# EAGLE design AutoPBT (EAGLE 9.7.0)
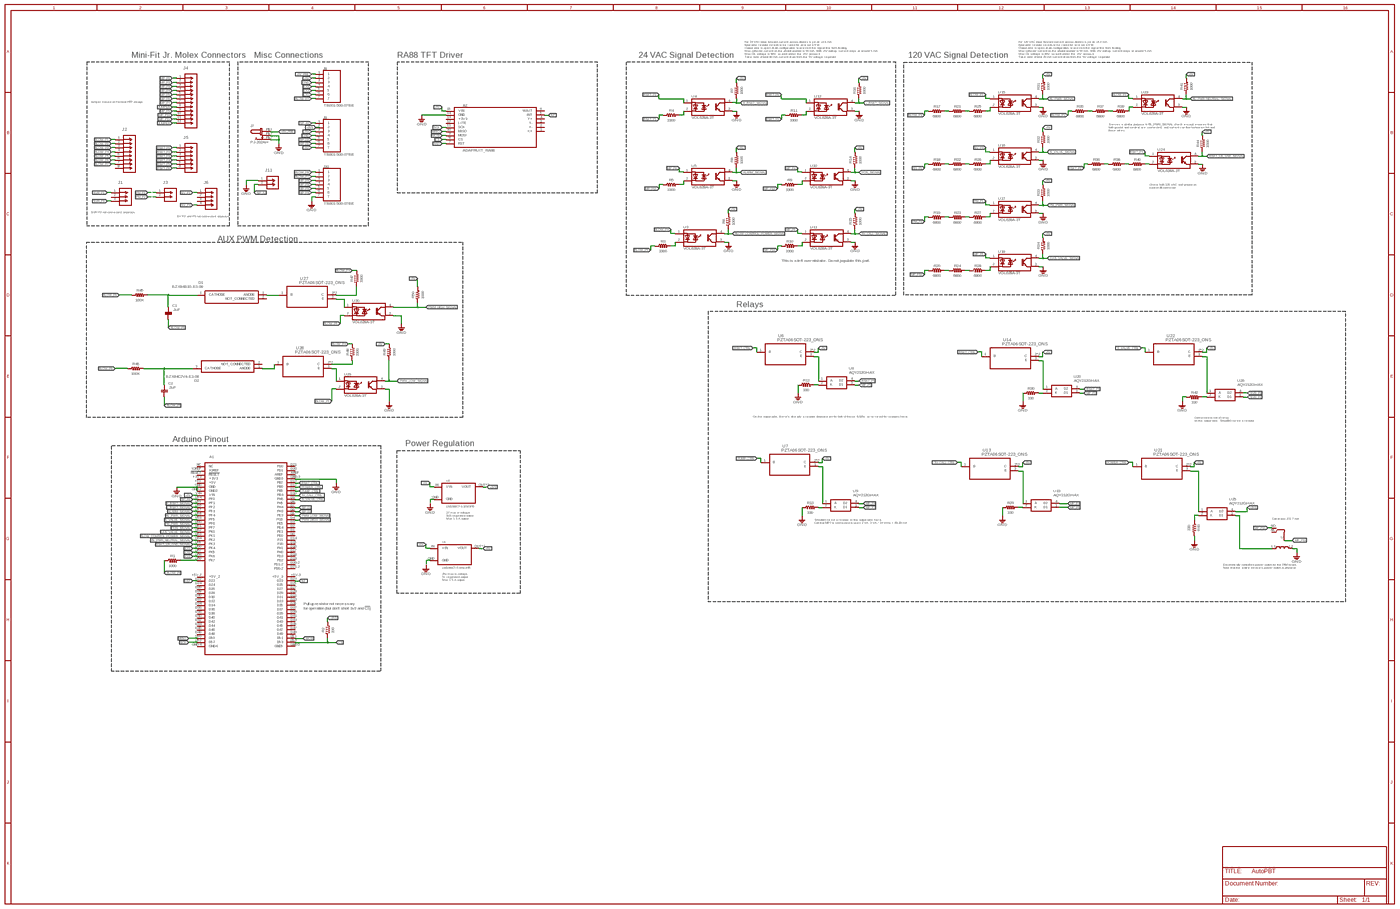
[diagram p0: schematic, sheet 1, overview]
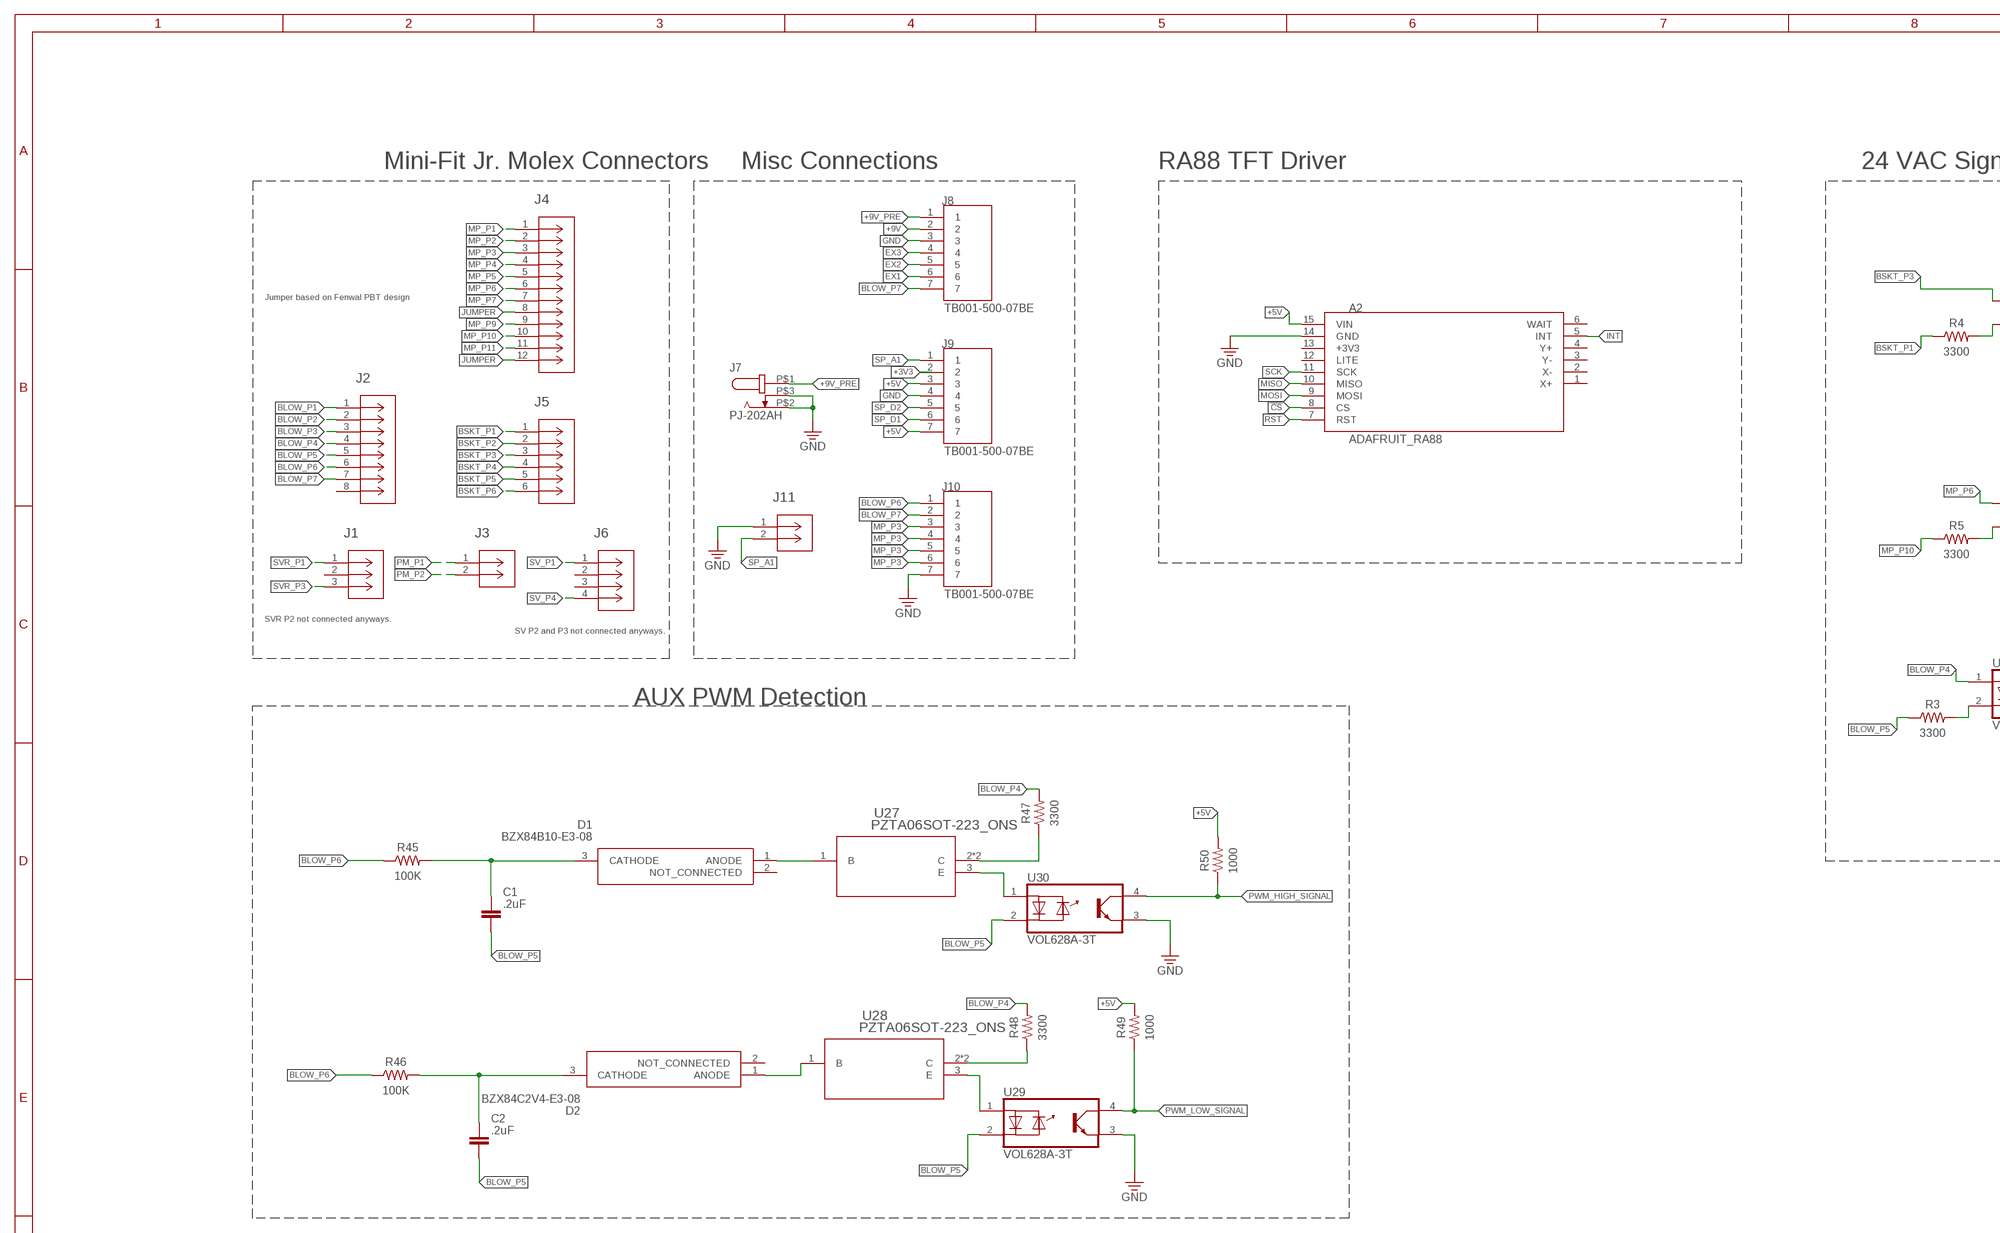
[diagram p1: schematic, sheet 1, part 1 of 4]
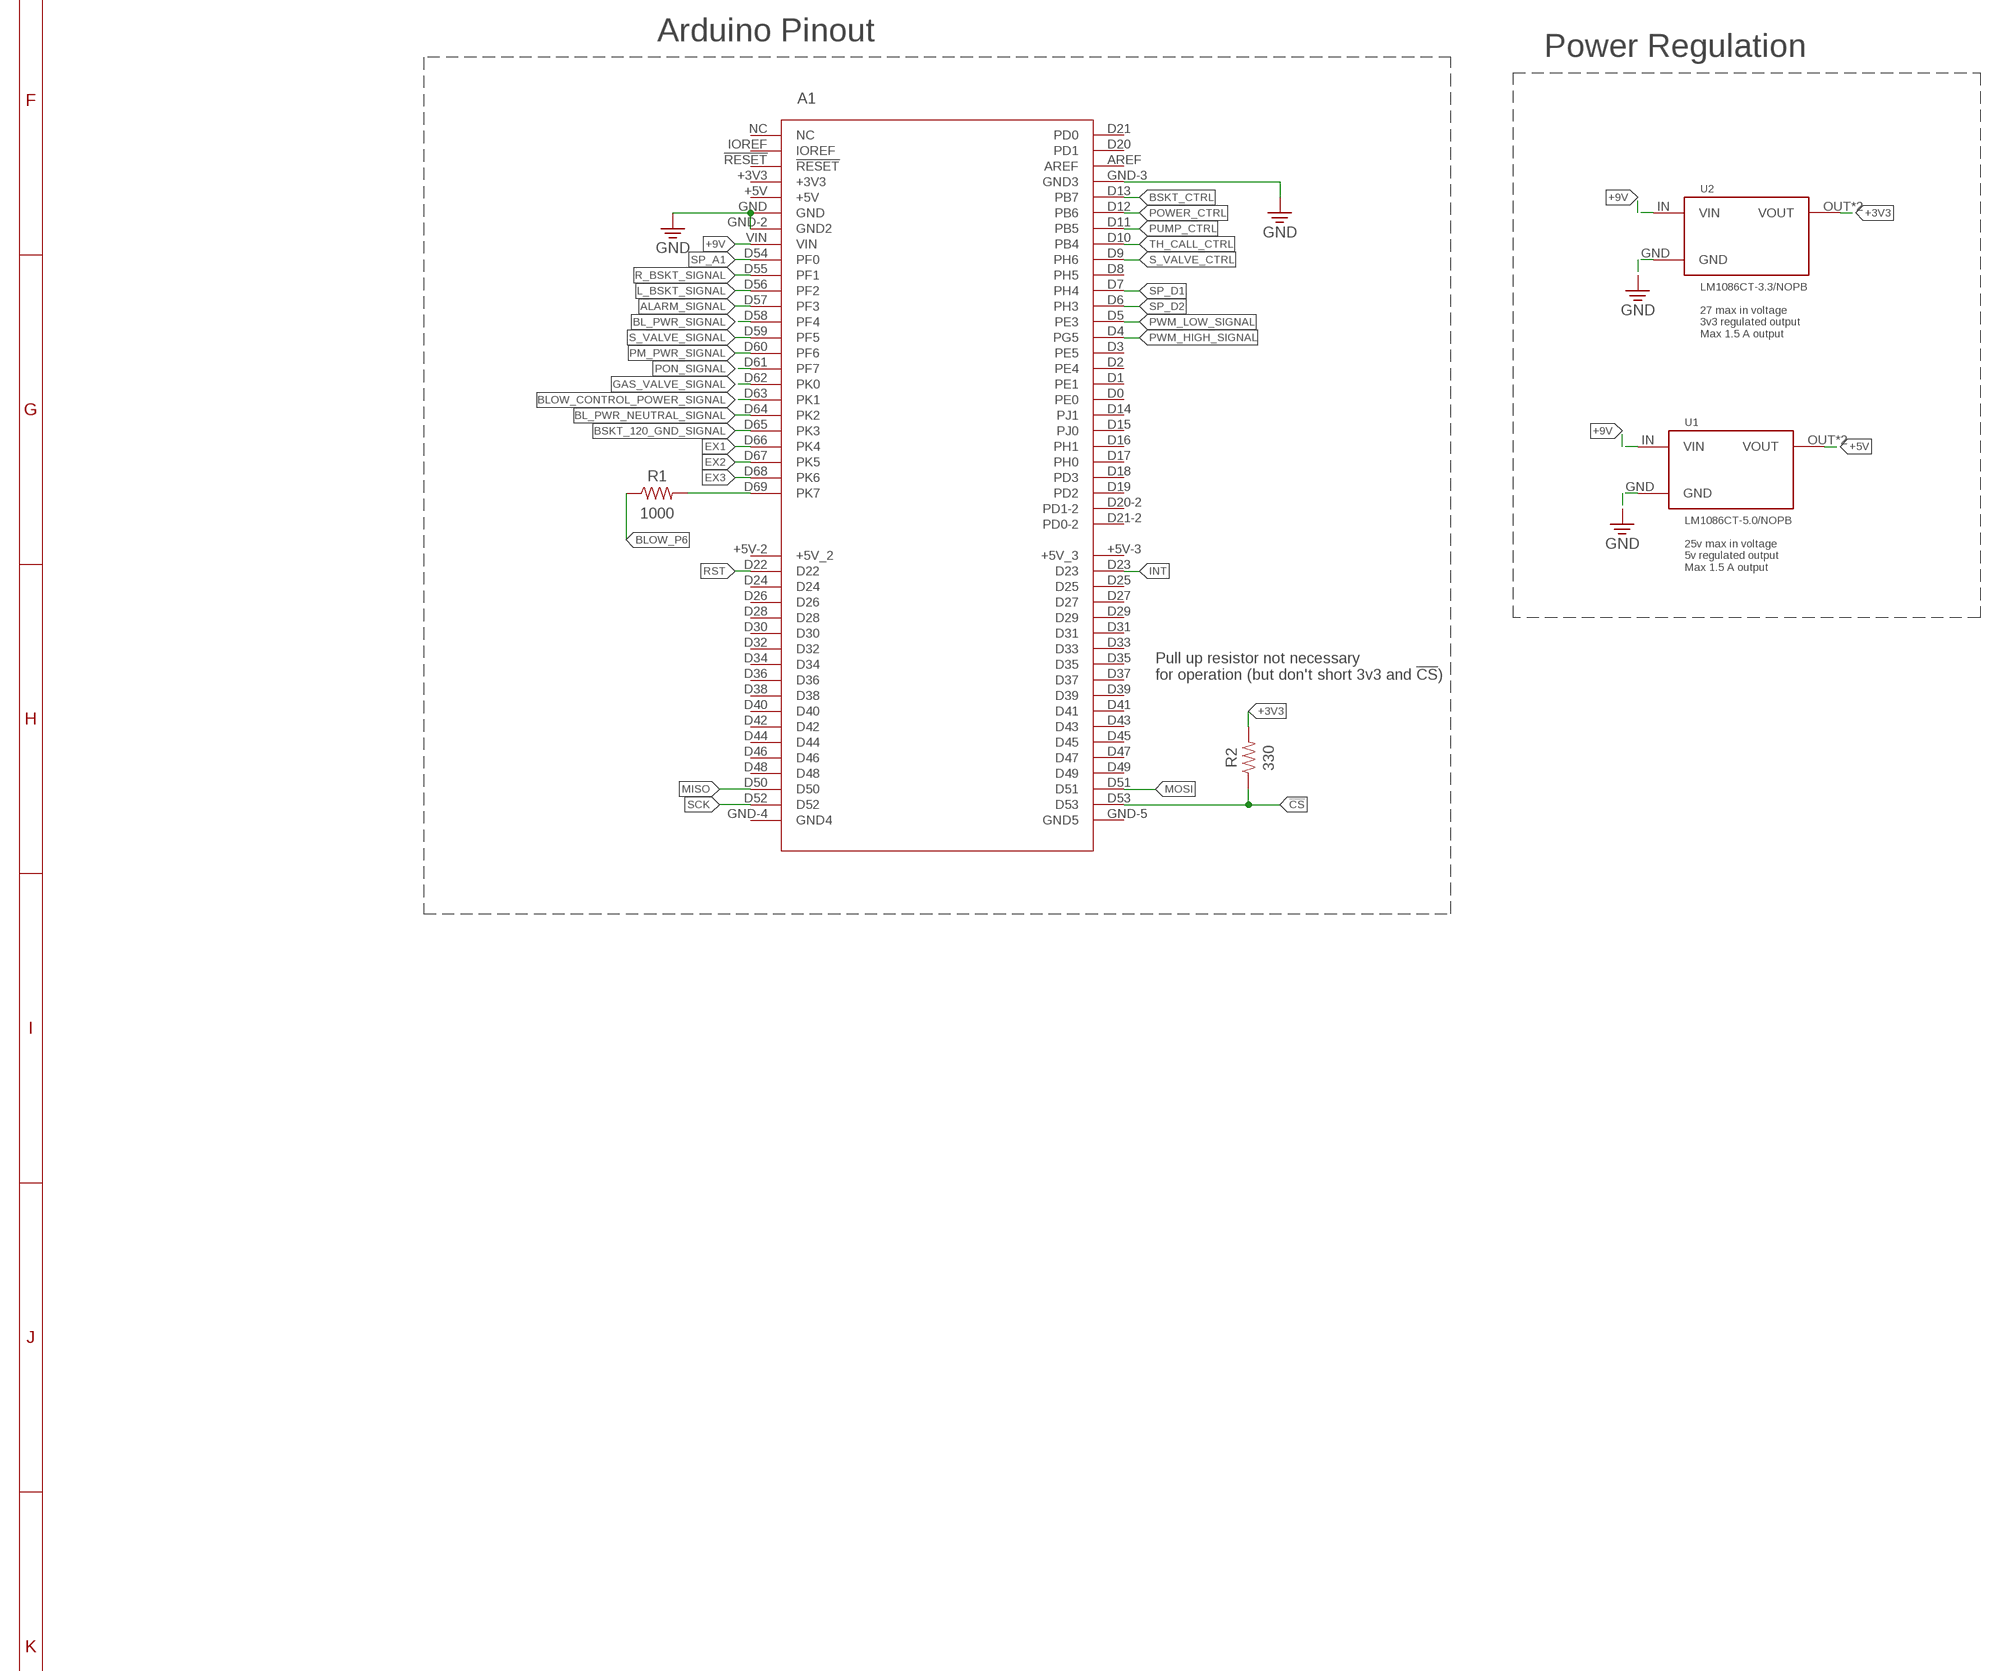
[diagram p2: schematic, sheet 1, part 2 of 4]
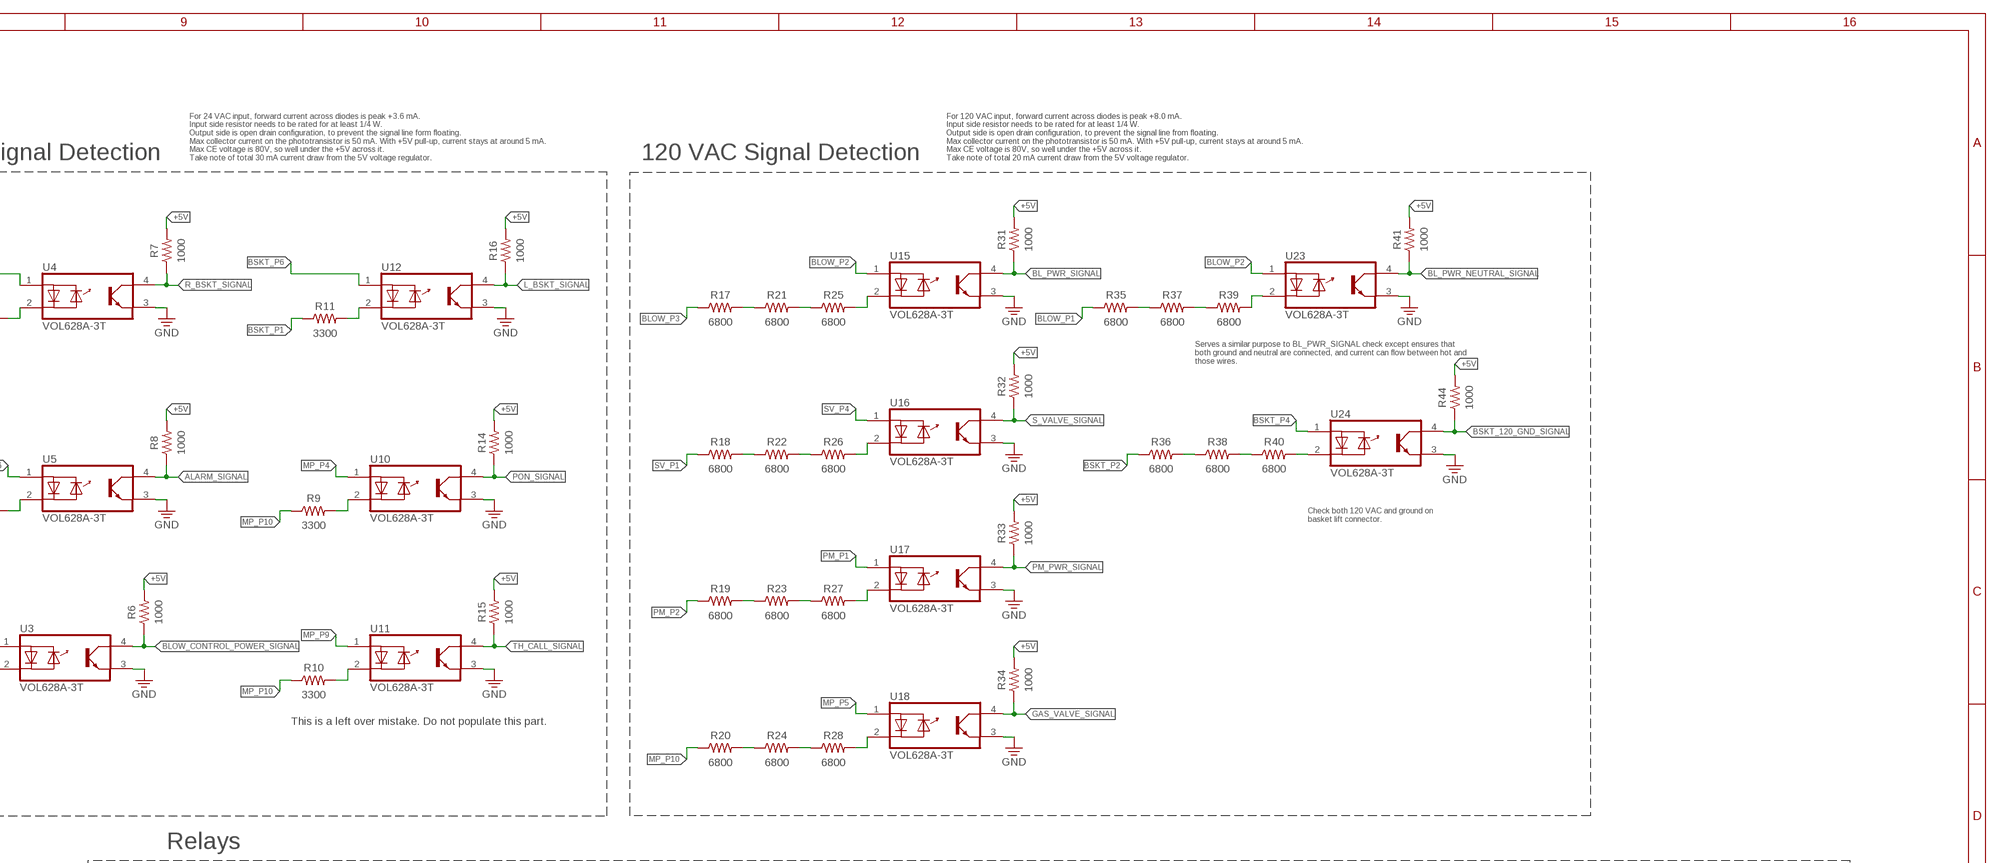
[diagram p3: schematic, sheet 1, part 3 of 4]
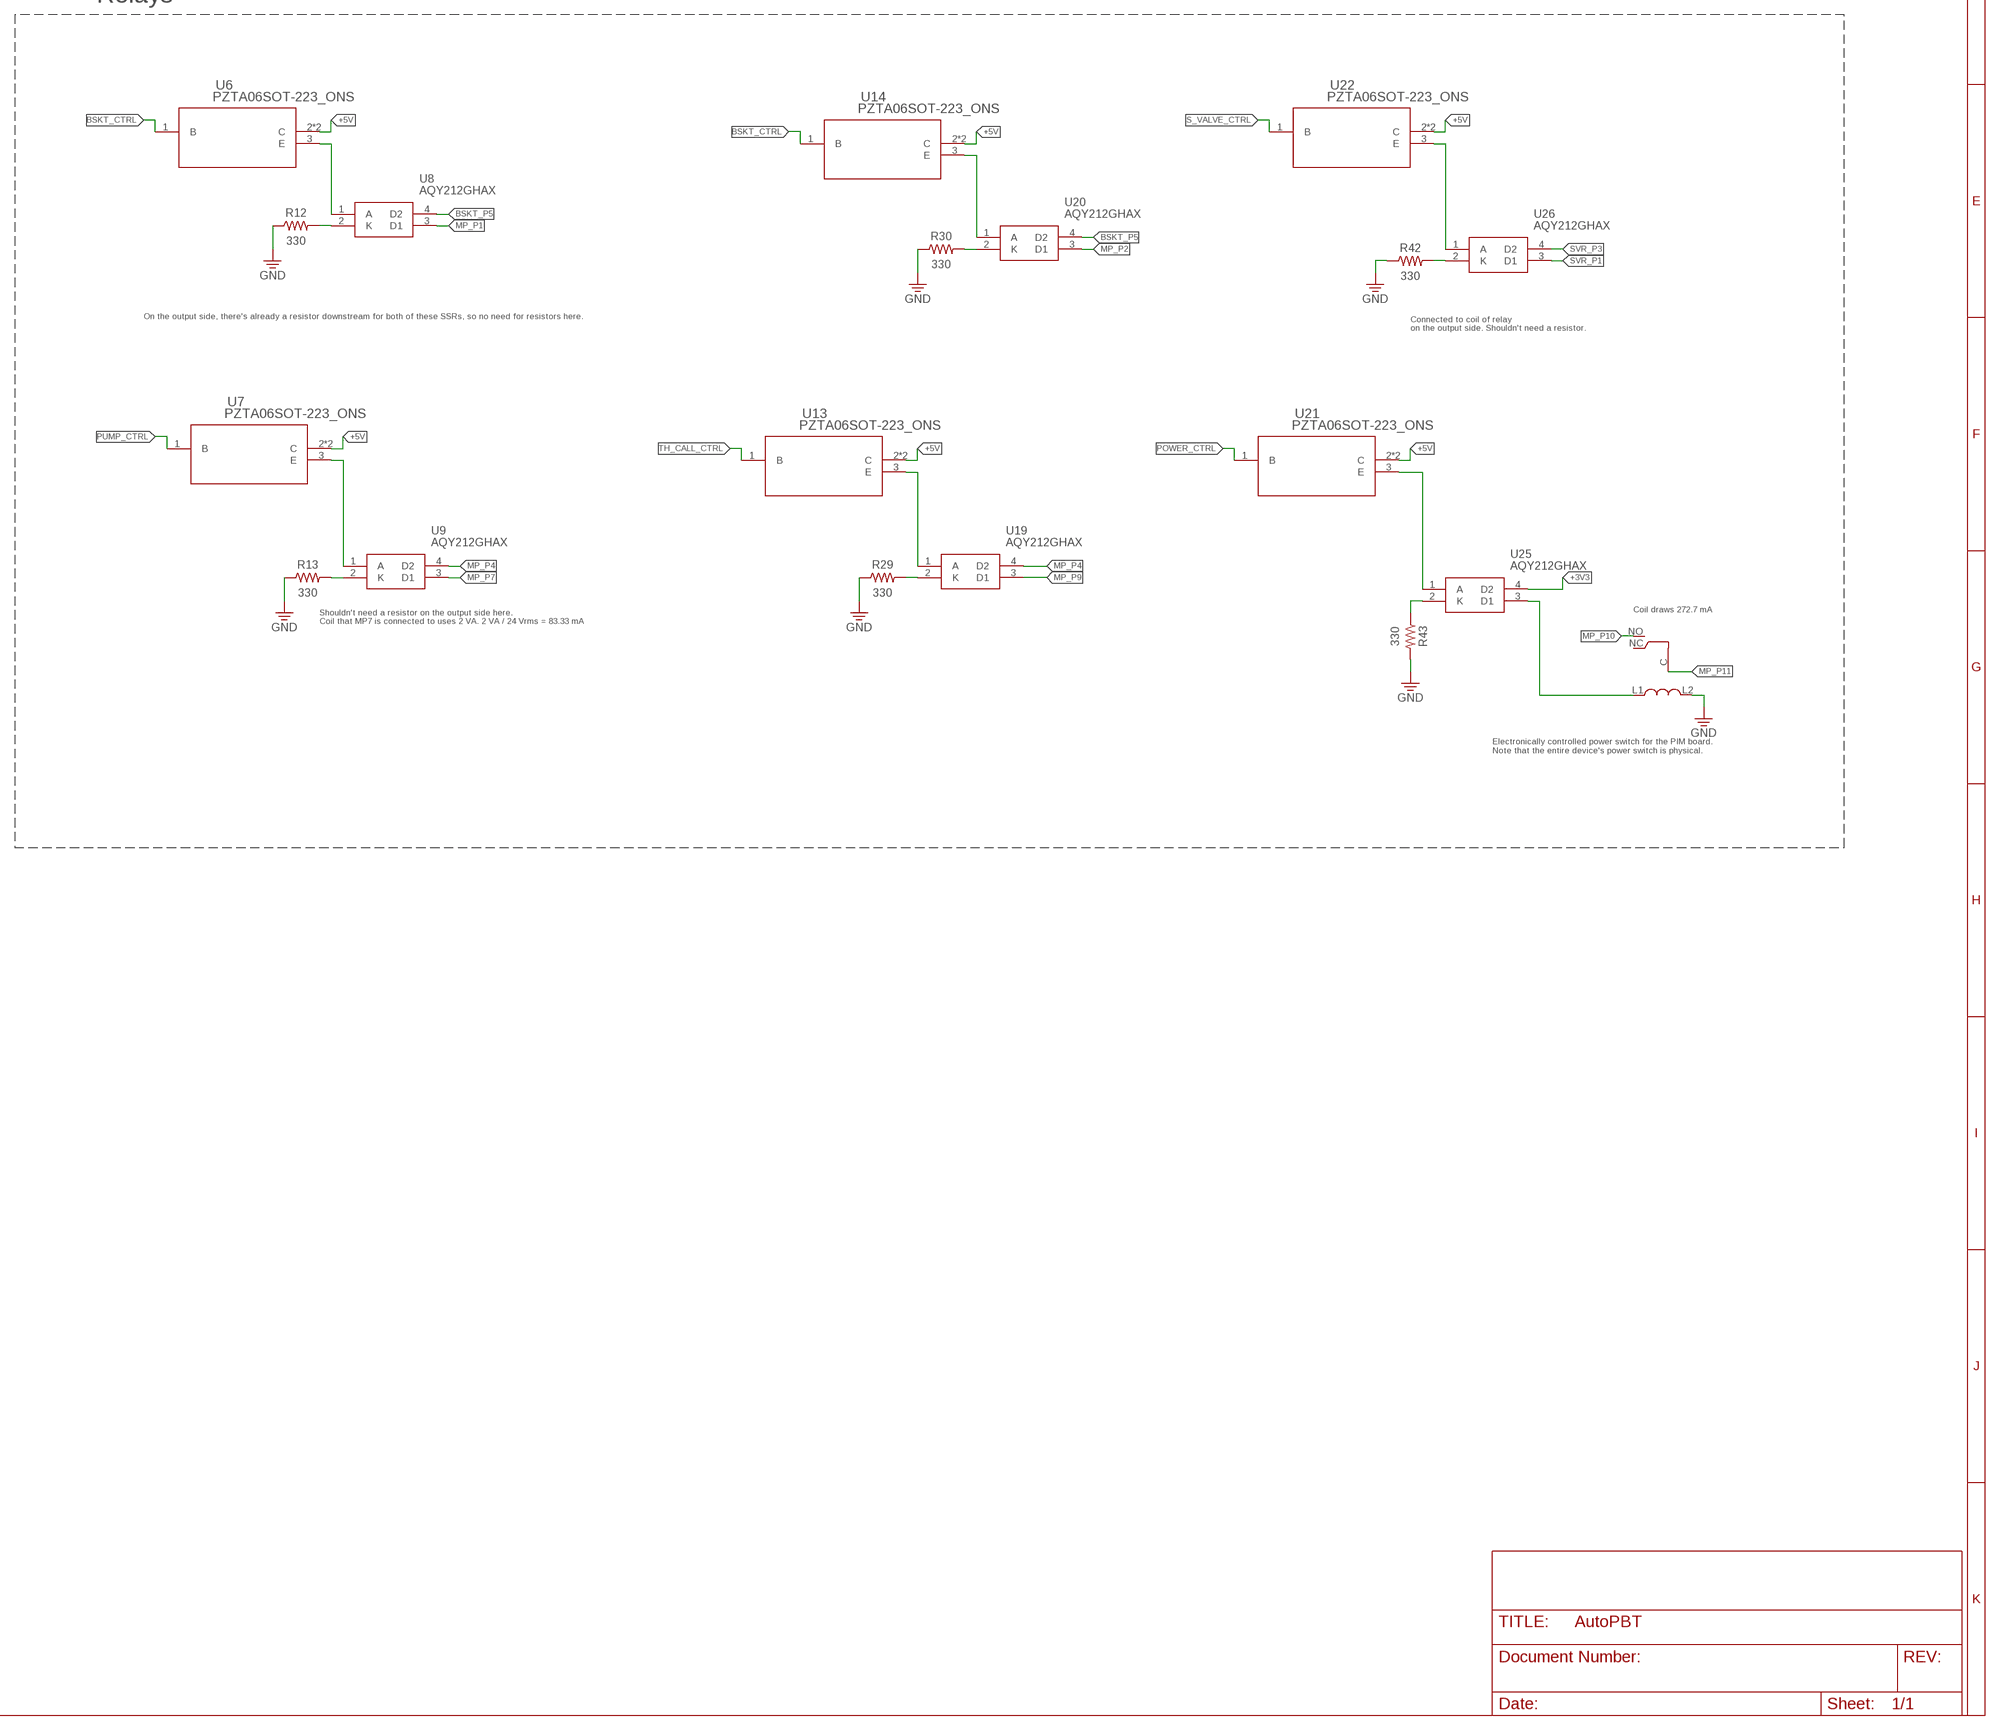
[diagram p4: schematic, sheet 1, part 4 of 4]

## Parts
A1  ARDUINO2560ARDUINO2560ACTUAL  [ARDUINO2560PINS]
A2  ADAFRUIT_RA88  [RA88]
C1  .2uF  C_CHIP-0603(1608-METRIC)  [CAPC1608X85]
C2  .2uF  C_CHIP-0603(1608-METRIC)  [CAPC1608X85]
D1  BZX84B10-E3-08  [SOT95P248X115-3N]
D2  BZX84C2V4-E3-08  [SOT95P248X115-3N]
J1  39301039CON_39301039  [CON_39301039]
J2  39281083CON_39281083  [CON_39281083]
J3  39281023CON_39281023  [CON_39281023]
J4  39281123CON_39281123  [CON_39281123]
J5  39281063CON_39281063  [CON_39281063]
J6  39299046CON_39299046  [CON_39299046]
J7  PJ-202AH  [CUI_PJ-202AH]
J8  TB001-500-07BE  [CUI_TB001-500-07BE]
J9  TB001-500-07BE  [CUI_TB001-500-07BE]
J10  TB001-500-07BE  [CUI_TB001-500-07BE]
J11  430450212CON_430450212_MOL  [CON_430450212_MOL]
K1  J107F1CS203VDC.80  [J107F1CS203VDC.80]
R1  1000  R-US_CHIP-0603(1608-METRIC)  [RESC1608X60]
R2  330  R-US_CHIP-0603(1608-METRIC)  [RESC1608X60]
R3  3300  R-US_CHIP-0603(1608-METRIC)  [RESC1608X60]
R4  3300  R-US_CHIP-0603(1608-METRIC)  [RESC1608X60]
R5  3300  R-US_CHIP-0603(1608-METRIC)  [RESC1608X60]
R6  1000  R-US_CHIP-0603(1608-METRIC)  [RESC1608X60]
R7  1000  R-US_CHIP-0603(1608-METRIC)  [RESC1608X60]
R8  1000  R-US_CHIP-0603(1608-METRIC)  [RESC1608X60]
R9  3300  R-US_CHIP-0603(1608-METRIC)  [RESC1608X60]
R10  3300  R-US_CHIP-0603(1608-METRIC)  [RESC1608X60]
R11  3300  R-US_CHIP-0603(1608-METRIC)  [RESC1608X60]
R12  330  R-US_CHIP-0603(1608-METRIC)  [RESC1608X60]
R13  330  R-US_CHIP-0603(1608-METRIC)  [RESC1608X60]
R14  1000  R-US_CHIP-0603(1608-METRIC)  [RESC1608X60]
R15  1000  R-US_CHIP-0603(1608-METRIC)  [RESC1608X60]
R16  1000  R-US_CHIP-0603(1608-METRIC)  [RESC1608X60]
R17  6800  R-US_CHIP-0603(1608-METRIC)  [RESC1608X60]
R18  6800  R-US_CHIP-0603(1608-METRIC)  [RESC1608X60]
R19  6800  R-US_CHIP-0603(1608-METRIC)  [RESC1608X60]
R20  6800  R-US_CHIP-0603(1608-METRIC)  [RESC1608X60]
R21  6800  R-US_CHIP-0603(1608-METRIC)  [RESC1608X60]
R22  6800  R-US_CHIP-0603(1608-METRIC)  [RESC1608X60]
R23  6800  R-US_CHIP-0603(1608-METRIC)  [RESC1608X60]
R24  6800  R-US_CHIP-0603(1608-METRIC)  [RESC1608X60]
R25  6800  R-US_CHIP-0603(1608-METRIC)  [RESC1608X60]
R26  6800  R-US_CHIP-0603(1608-METRIC)  [RESC1608X60]
R27  6800  R-US_CHIP-0603(1608-METRIC)  [RESC1608X60]
R28  6800  R-US_CHIP-0603(1608-METRIC)  [RESC1608X60]
R29  330  R-US_CHIP-0603(1608-METRIC)  [RESC1608X60]
R30  330  R-US_CHIP-0603(1608-METRIC)  [RESC1608X60]
R31  1000  R-US_CHIP-0603(1608-METRIC)  [RESC1608X60]
R32  1000  R-US_CHIP-0603(1608-METRIC)  [RESC1608X60]
R33  1000  R-US_CHIP-0603(1608-METRIC)  [RESC1608X60]
R34  1000  R-US_CHIP-0603(1608-METRIC)  [RESC1608X60]
R35  6800  R-US_CHIP-0603(1608-METRIC)  [RESC1608X60]
R36  6800  R-US_CHIP-0603(1608-METRIC)  [RESC1608X60]
R37  6800  R-US_CHIP-0603(1608-METRIC)  [RESC1608X60]
R38  6800  R-US_CHIP-0603(1608-METRIC)  [RESC1608X60]
R39  6800  R-US_CHIP-0603(1608-METRIC)  [RESC1608X60]
R40  6800  R-US_CHIP-0603(1608-METRIC)  [RESC1608X60]
R41  1000  R-US_CHIP-0603(1608-METRIC)  [RESC1608X60]
R42  330  R-US_CHIP-0603(1608-METRIC)  [RESC1608X60]
R43  330  R-US_CHIP-0603(1608-METRIC)  [RESC1608X60]
R44  1000  R-US_CHIP-0603(1608-METRIC)  [RESC1608X60]
R45  100K  R-US_CHIP-0603(1608-METRIC)  [RESC1608X60]
R46  100K  R-US_CHIP-0603(1608-METRIC)  [RESC1608X60]
R47  3300  R-US_CHIP-0603(1608-METRIC)  [RESC1608X60]
R48  3300  R-US_CHIP-0603(1608-METRIC)  [RESC1608X60]
R49  1000  R-US_CHIP-0603(1608-METRIC)  [RESC1608X60]
R50  1000  R-US_CHIP-0603(1608-METRIC)  [RESC1608X60]
U1  LM1086CT-5.0/NOPB  [LM1086CT-3.3/NOPB]
U2  LM1086CT-3.3/NOPB  [LM1086CT-3.3/NOPB]
U3  VOL628A-3T  [SOIC254P1020X230-4N]
U4  VOL628A-3T  [SOIC254P1020X230-4N]
U5  VOL628A-3T  [SOIC254P1020X230-4N]
U6  PZTA06SOT-223_ONS  [SOT-223_ONS]
U7  PZTA06SOT-223_ONS  [SOT-223_ONS]
U8  AQY212GHAX  [SOP254P962X315-4N]
U9  AQY212GHAX  [SOP254P962X315-4N]
U10  VOL628A-3T  [SOIC254P1020X230-4N]
U11  VOL628A-3T  [SOIC254P1020X230-4N]
U12  VOL628A-3T  [SOIC254P1020X230-4N]
U13  PZTA06SOT-223_ONS  [SOT-223_ONS]
U14  PZTA06SOT-223_ONS  [SOT-223_ONS]
U15  VOL628A-3T  [SOIC254P1020X230-4N]
U16  VOL628A-3T  [SOIC254P1020X230-4N]
U17  VOL628A-3T  [SOIC254P1020X230-4N]
U18  VOL628A-3T  [SOIC254P1020X230-4N]
U19  AQY212GHAX  [SOP254P962X315-4N]
U20  AQY212GHAX  [SOP254P962X315-4N]
U21  PZTA06SOT-223_ONS  [SOT-223_ONS]
U22  PZTA06SOT-223_ONS  [SOT-223_ONS]
U23  VOL628A-3T  [SOIC254P1020X230-4N]
U24  VOL628A-3T  [SOIC254P1020X230-4N]
U25  AQY212GHAX  [SOP254P962X315-4N]
U26  AQY212GHAX  [SOP254P962X315-4N]
U27  PZTA06SOT-223_ONS  [SOT-223_ONS]
U28  PZTA06SOT-223_ONS  [SOT-223_ONS]
U29  VOL628A-3T  [SOIC254P1020X230-4N]
U30  VOL628A-3T  [SOIC254P1020X230-4N]

## Nets
!CS! [SPI]: A1.D53 A2.8(CS) R2.1
+3V3: J9.2 R2.2 U2.OUT2(VOUT) U2.OUT(VOUT) U25.4(D2)
+5V: A2.15(VIN) J9.3 J9.7 R6.2 R7.2 R8.2 R14.2 R15.2 R16.2 R31.2 R32.2 R33.2 R34.2 R41.2 R44.2 R49.2 R50.2 U1.OUT2(VOUT) U1.OUT(VOUT) U6.2(C) U6.4(C) U7.2(C) U7.4(C) U13.2(C) U13.4(C) U14.2(C) U14.4(C) U21.2(C) U21.4(C) U22.2(C) U22.4(C)
+9V: A1.VIN J8.2 U1.IN(VIN) U2.IN(VIN)
+9V_PRE: J7.P$1 J8.1
ALARM_SIGNAL: A1.D57(PF3) R8.1 U5.4(CO)
BL_PWR_NEUTRAL_SIGNAL: A1.D64(PK2) R41.1 U23.4(CO)
BL_PWR_SIGNAL: A1.D58(PF4) R31.1 U15.4(CO)
BLOW_CONTROL_POWER_SIGNAL: A1.D63(PK1) R6.1 U3.4(CO)
BLOW_P1: J2.1 R35.1
BLOW_P2: J2.2 U15.1(A/C) U23.1(A/C)
BLOW_P3: J2.3 R17.1
BLOW_P4: J2.4 R47.2 R48.2 U3.1(A/C)
BLOW_P5: C1.2 C2.2 J2.5 R3.1 U29.2(C/A) U30.2(C/A)
BLOW_P6: J2.6 J10.1 R1.1 R45.1 R46.1
BLOW_P7: J2.7 J8.7 J10.2
BSKT_120_GND_SIGNAL: A1.D65(PK3) R44.1 U24.4(CO)
BSKT_CTRL: A1.D13(PB7) U6.1(B) U14.1(B)
BSKT_P1: J5.1 R4.1 R11.1
BSKT_P2: J5.2 R36.1
BSKT_P3: J5.3 U4.1(A/C)
BSKT_P4: J5.4 U24.1(A/C)
BSKT_P5: J5.5 U8.4(D2) U20.4(D2)
BSKT_P6: J5.6 U12.1(A/C)
EX1: A1.D66(PK4) J8.6
EX2: A1.D67(PK5) J8.5
EX3: A1.D68(PK6) J8.4
GAS_VALVE_SIGNAL: A1.D62(PK0) R34.1 U18.4(CO)
GND: A1.GND A1.GND-2(GND2) A1.GND-3(GND3) A2.14(GND) J7.P$2 J7.P$3 J8.3 J9.4 J10.7 J11.1 K1.L2 R12.1 R13.1 R29.1 R30.1 R42.1 R43.2 U1.GND U2.GND U3.3(E) U4.3(E) U5.3(E) U10.3(E) U11.3(E) U12.3(E) U15.3(E) U16.3(E) U17.3(E) U18.3(E) U23.3(E) U24.3(E) U29.3(E) U30.3(E)
INT: A1.D23 A2.5(INT)
JUMPER: J4.8 J4.12
L_BSKT_SIGNAL: A1.D56(PF2) R16.1 U12.4(CO)
MISO [SPI]: A1.D50 A2.10(MISO)
MOSI [SPI]: A1.D51 A2.9(MOSI)
MP_P1: J4.1 U8.3(D1)
MP_P2: J4.2 U20.3(D1)
MP_P3: J4.3 J10.3 J10.4 J10.5 J10.6
MP_P4: J4.4 U9.4(D2) U10.1(A/C) U19.4(D2)
MP_P5: J4.5 U18.1(A/C)
MP_P6: J4.6 U5.1(A/C)
MP_P7: J4.7 U9.3(D1)
MP_P9: J4.9 U11.1(A/C) U19.3(D1)
MP_P10: J4.10 K1.NO R5.1 R9.1 R10.1 R20.1
MP_P11: J4.11 K1.C
N$1: R30.2 U20.2(K)
N$2: R29.2 U19.2(K)
N$3: R13.2 U9.2(K)
N$4: U6.3(E) U8.1(A)
N$5: R42.2 U26.2(K)
N$6: R43.1 U25.2(K)
N$8: U14.3(E) U20.1(A)
N$9: R39.2 U23.2(C/A)
N$10: R37.2 R39.1
N$11: R35.2 R37.1
N$12: R40.2 U24.2(C/A)
N$13: R38.2 R40.1
N$14: R36.2 R38.1
N$15: U22.3(E) U26.1(A)
N$16: U7.3(E) U9.1(A)
N$17: R9.2 U10.2(C/A)
N$18: U13.3(E) U19.1(A)
N$19: U21.3(E) U25.1(A)
N$20: R11.2 U12.2(C/A)
N$21: C2.1 D2.3(CATHODE) R46.2
N$22: R3.2 U3.2(C/A)
N$23: R4.2 U4.2(C/A)
N$24: D2.1(ANODE) U28.1(B)
N$25: R10.2 U11.2(C/A)
N$26: R5.2 U5.2(C/A)
N$27: A1.D69(PK7) R1.2
N$28: R25.2 U15.2(C/A)
N$29: R21.2 R25.1
N$30: R17.2 R21.1
N$31: R26.2 U16.2(C/A)
N$32: R22.2 R26.1
N$33: R18.2 R22.1
N$34: R27.2 U17.2(C/A)
N$35: R23.2 R27.1
N$36: R19.2 R23.1
N$37: R28.2 U18.2(C/A)
N$38: R24.2 R28.1
N$39: R20.2 R24.1
N$40: R12.2 U8.2(K)
N$41: D1.1(ANODE) U27.1(B)
N$42: C1.1 D1.3(CATHODE) R45.2
N$44: U28.3(E) U29.1(A/C)
N$45: U27.3(E) U30.1(A/C)
N$48: R47.1 U27.2(C) U27.4(C)
N$49: R48.1 U28.2(C) U28.4(C)
PM_P1: J3.1 U17.1(A/C)
PM_P2: J3.2 R19.1
PM_PWR_SIGNAL: A1.D60(PF6) R33.1 U17.4(CO)
PON_SIGNAL: A1.D61(PF7) R14.1 U10.4(CO)
POWER_CTRL: A1.D12(PB6) U21.1(B)
PUMP_CTRL: A1.D11(PB5) U7.1(B)
PWM_HIGH_SIGNAL: A1.D4(PG5) R50.1 U30.4(CO)
PWM_LOW_SIGNAL: A1.D5(PE3) R49.1 U29.4(CO)
R_BSKT_SIGNAL: A1.D55(PF1) R7.1 U4.4(CO)
RELAY_POW: K1.L1 U25.3(D1)
RST: A1.D22 A2.7(RST)
S_VALVE_CTRL: A1.D9(PH6) U22.1(B)
S_VALVE_SIGNAL: A1.D59(PF5) R32.1 U16.4(CO)
SCK [SPI]: A1.D52 A2.11(SCK)
SP_A1: A1.D54(PF0) J9.1 J11.2
SP_D1: A1.D7(PH4) J9.6
SP_D2: A1.D6(PH3) J9.5
SV_P1: J6.1 R18.1
SV_P4: J6.4 U16.1(A/C)
SVR_P1: J1.1 U26.3(D1)
SVR_P3: J1.3 U26.4(D2)
TH_CALL_CTRL: A1.D10(PB4) U13.1(B)
TH_CALL_SIGNAL: R15.1 U11.4(CO)
Unconnected: A1.!RESET! A1.+3V3 A1.+5V A1.+5V-2(+5V_2) A1.+5V-3(+5V_3) A1.AREF A1.D0(PE0) A1.D1(PE1) A1.D2(PE4) A1.D3(PE5) A1.D8(PH5) A1.D14(PJ1) A1.D15(PJ0) A1.D16(PH1) A1.D17(PH0) A1.D18(PD3) A1.D19(PD2) A1.D20(PD1) A1.D20-2(PD1-2) A1.D21(PD0) A1.D21-2(PD0-2) A1.D24 A1.D25 A1.D26 A1.D27 A1.D28 A1.D29 A1.D30 A1.D31 A1.D32 A1.D33 A1.D34 A1.D35 A1.D36 A1.D37 A1.D38 A1.D39 A1.D40 A1.D41 A1.D42 A1.D43 A1.D44 A1.D45 A1.D46 A1.D47 A1.D48 A1.D49 A1.GND-4(GND4) A1.GND-5(GND5) A1.IOREF A1.NC A2.1(X+) A2.2(X-) A2.3(Y-) A2.4(Y+) A2.6(WAIT) A2.12(LITE) A2.13(+3V3) D1.2(NOT_CONNECTED) D2.2(NOT_CONNECTED) J1.2 J2.8 J6.2 J6.3 K1.NC

## Notes on the sheet
- Mini-Fit Jr. Molex Connectors | Misc Connections | RA88 TFT Driver | 24 VAC Signal Detection
- For 24 VAC input, forward current across diodes is peak +3.6 mA.
  Input side resistor needs to be rated for at least 1/4 W.
  Output side is open drain configuration, to prevent the signal line form floating. 
  Max collector current on the phototransistor is 50 mA. With +5V pull-up, current stays at around 5 mA. 
  Max CE voltage is 80V, so well under the +5V across it.
  Take note of total 30 mA current draw from the 5V voltage regulator.
- 120 VAC Signal Detection
- For 120 VAC input, forward current across diodes is peak +8.0 mA.
  Input side resistor needs to be rated for at least 1/4 W.
  Output side is open drain configuration, to prevent the signal line from floating. 
  Max collector current on the phototransistor is 50 mA. With +5V pull-up, current stays at around 5 mA. 
  Max CE voltage is 80V, so well under the +5V across it.
  Take note of total 20 mA current draw from the 5V voltage regulator.
- Jumper based on Fenwal PBT design
- Serves a similar purpose to BL_PWR_SIGNAL check except ensures that 
  both ground and neutral are connected, and current can flow between hot and 
  those wires.
- Check both 120 VAC and ground on
  basket lift connector.
- SVR P2 not connected anyways.
- SV P2 and P3 not connected anyways.
- AUX PWM Detection
- This is a left over mistake. Do not populate this part.
- Relays
- On the output side, there's already a resistor downstream for both of these SSRs, so no need for resistors here.
- Connected to coil of relay
  on the output side. Shouldn't need a resistor.
- Arduino Pinout
- Power Regulation
- 27 max in voltage
  3v3 regulated output
  Max 1.5 A output
- Coil draws 272.7 mA
- Shouldn't need a resistor on the output side here. 
  Coil that MP7 is connected to uses 2 VA. 2 VA / 24 Vrms = 83.33 mA
- Electronically controlled power switch for the PIM board. 
  Note that the entire device's power switch is physical.
- 25v max in voltage
  5v regulated output
  Max 1.5 A output
- Pull up resistor not necessary 
  for operation (but don't short 3v3 and !CS!)

## Library data of the parts
A1 = ADVANCEDPBTLIB:ARDUINO2560
A2 = ADVANCEDPBTLIB:ADAFRUIT_RA88
C1 C2 = Capacitor:C: Capacitor - Generic; CATEGORY: Capacitor
D1 = ADVANCEDPBTLIB:BZX84B10-E3-08
D2 = ADVANCEDPBTLIB:BZX84C2V4-E3-08: Zener Diodes 2.4 Volt 0.35W 5% Source: Datasheet <https://componentsearchengine.com/Datasheets/1/BZX84C2V4-E3-08.pdf>; ARROW_PART_NUMBER: BZX84C2V4-E3-08; ARROW_PRICE-STOCK: https://www.arrow.com/en/products/bzx84c2v4-e3-08/vishay; DESCRIPTION: Zener Diodes 2.4 Volt 0.35W 5%; HEIGHT: 1.15mm; MANUFACTURER_NAME: Vishay; MANUFACTURER_PART_NUMBER: BZX84C2V4-E3-08; MOUSER_PART_NUMBER: 78-BZX84C2V4-E3-08; MOUSER_PRICE-STOCK: https://www.mouser.co.uk/ProductDetail/Vishay-Semiconductors/BZX84C2V4-E3-08?qs=KP8Io%2FXyE5Sb0eHjk15Scw%3D%3D
J1 = ADVANCEDPBTLIB:39301039; COPYRIGHT: Copyright (C) 2022 Ultra Librarian. All rights reserved.; MANUFACTURER_PART_NUMBER: 39301039; MFR_NAME: Molex Connector Corporation
J2 = ADVANCEDPBTLIB:39281083; COPYRIGHT: Copyright (C) 2022 Ultra Librarian. All rights reserved.; MANUFACTURER_PART_NUMBER: 39281083; MFR_NAME: Molex Connector Corporation
J3 = ADVANCEDPBTLIB:39281023; COPYRIGHT: Copyright (C) 2022 Ultra Librarian. All rights reserved.; MANUFACTURER_PART_NUMBER: 39281023; MFR_NAME: Molex Connector Corporation
J4 = ADVANCEDPBTLIB:39281123; COPYRIGHT: Copyright (C) 2022 Ultra Librarian. All rights reserved.; MANUFACTURER_PART_NUMBER: 39281123; MFR_NAME: Molex Connector Corporation
J5 = ADVANCEDPBTLIB:39281063; COPYRIGHT: Copyright (C) 2022 Ultra Librarian. All rights reserved.; MANUFACTURER_PART_NUMBER: 39281063; MFR_NAME: Molex Connector Corporation
J6 = ADVANCEDPBTLIB:39299046; COPYRIGHT: Copyright (C) 2022 Ultra Librarian. All rights reserved.; MANUFACTURER_PART_NUMBER: 39299046; MFR_NAME: Molex Connector Corporation
J7 = ADVANCEDPBTLIB:PJ-202AH: 2.0 mm Center Pin, 5.0 A, Right Angle, Through Hole, Kinked Pins, Dc Power Jack Connector; MANUFACTURER: CUI INC; PART_REV: 1.02; STANDARD: Manufacturer recommendations
J8-J10 = ADVANCEDPBTLIB:TB001-500-07BE; MANUFACTURER: CUI; STANDARD: Manufacturer Recommendations
J11 = ADVANCEDPBTLIB:430450212; COPYRIGHT: Copyright (C) 2022 Ultra Librarian. All rights reserved.; MANUFACTURER_PART_NUMBER: 430450212; MFR_NAME: Molex Connector Corporation
K1 = ADVANCEDPBTLIB:J107F1CS203VDC.80
R1-R50 = Resistor:R-US: Resistor Fixed - ANSI; CATEGORY: Resistor; SUB-CATEGORY: Fixed
U1 = ADVANCEDPBTLIB:LM1086CT-5.0/NOPB
U2 = ADVANCEDPBTLIB:LM1086CT-3.3/NOPB
U3-U5 U10-U12 U15-U18 U23 U24 U29 U30 = ADVANCEDPBTLIB:VOL628A-3T: Optocoupler, Phototransistor Output, AC Input, Low Input Current, 4 Pin LSOP, Long Creepage Mini-Flat Package; MANUFACTURER: VISHAY
U6 U7 U13 U14 U21 U22 U27 U28 = ADVANCEDPBTLIB:PZTA06; COPYRIGHT: Copyright (C) 2022 Ultra Librarian. All rights reserved.; DIGI-KEY_PART_NUMBER_1: PZTA06TR-ND; DIGI-KEY_PART_NUMBER_2: PZTA06CT-ND; DIGI-KEY_PART_NUMBER_3: PZTA06DKR-ND; MANUFACTURER_PART_NUMBER: PZTA06; MFR_NAME: onsemi
U8 U9 U19 U20 U25 U26 = ADVANCEDPBTLIB:AQY212GHAX: PANASONIC - AQY212GHAX - MOSFET Relay, SPST-NO, 1.1 A, Gull Wing, 60 V, 0.7 ohm, 5 kV Source: Datasheet <https://www.digikey.in/product-detail/en/panasonic-electric-works/AQY212GHAX/255-6063-1-ND/8549338>; ARROW_PART_NUMBER: AQY212GHAX; ARROW_PRICE-STOCK: https://www.arrow.com/en/products/aqy212ghax/panasonic?region=europe; DESCRIPTION: PANASONIC - AQY212GHAX - MOSFET Relay, SPST-NO, 1.1 A, Gull Wing, 60 V, 0.7 ohm, 5 kV; HEIGHT: 3.15mm; MANUFACTURER_NAME: Panasonic; MANUFACTURER_PART_NUMBER: AQY212GHAX; MOUSER_PART_NUMBER: 667-AQY212GHAX; MOUSER_PRICE-STOCK: https://www.mouser.co.uk/ProductDetail/Panasonic-Industrial-Devices/AQY212GHAX?qs=wKtUvITRiamLwz7hthc4Hg%3D%3D

## Board
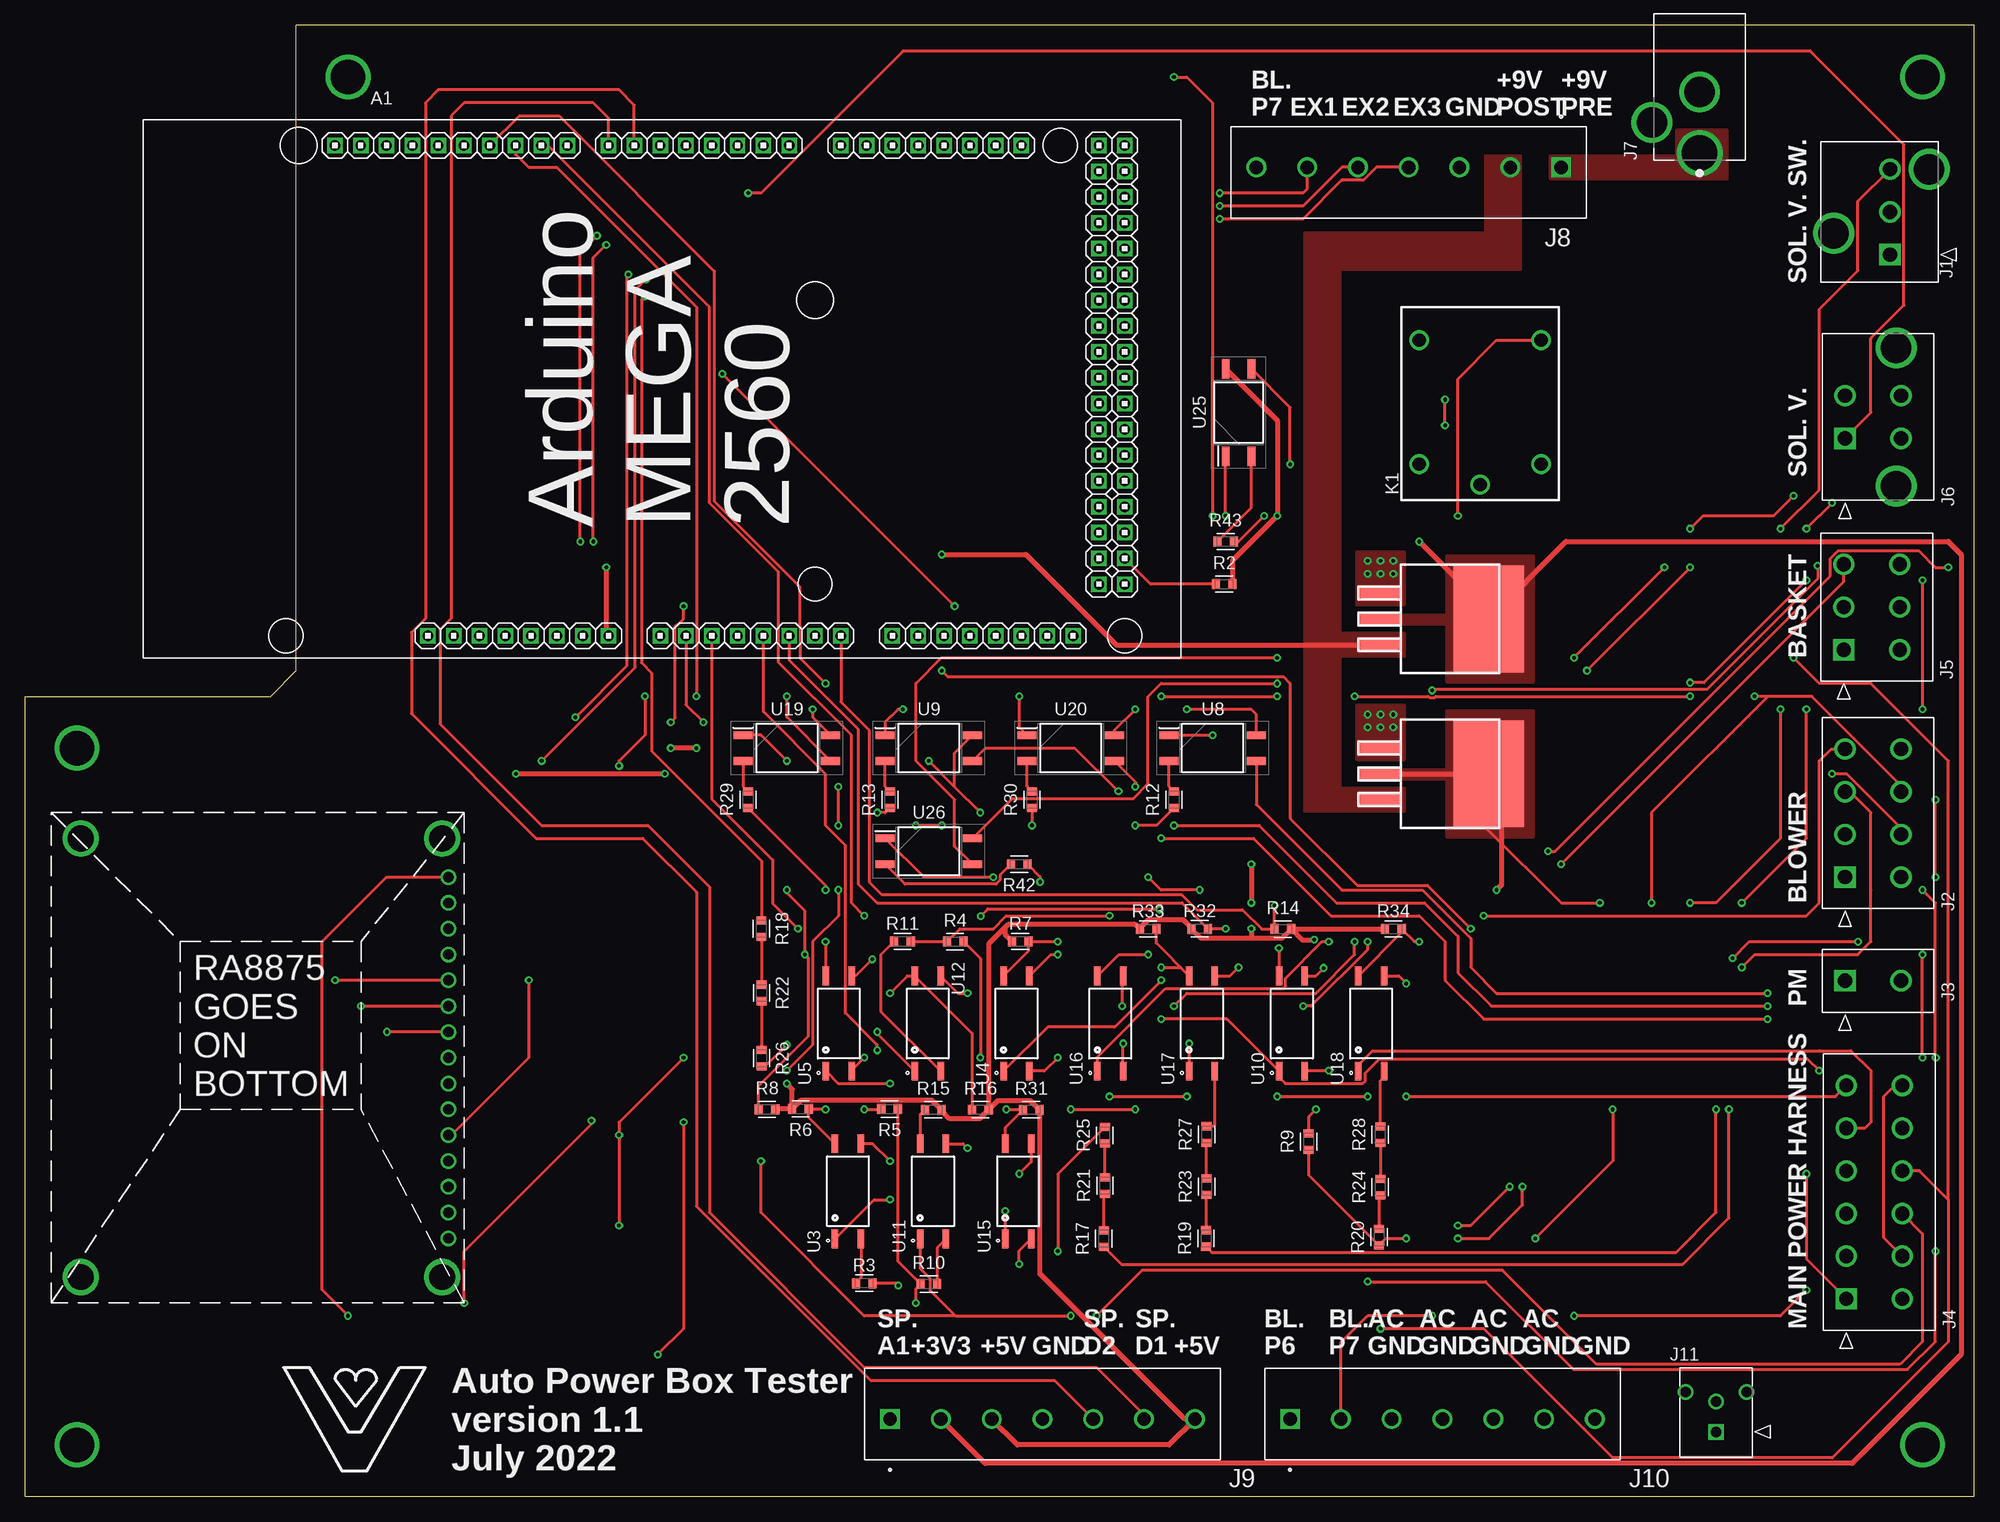
[diagram p5: board, top side]
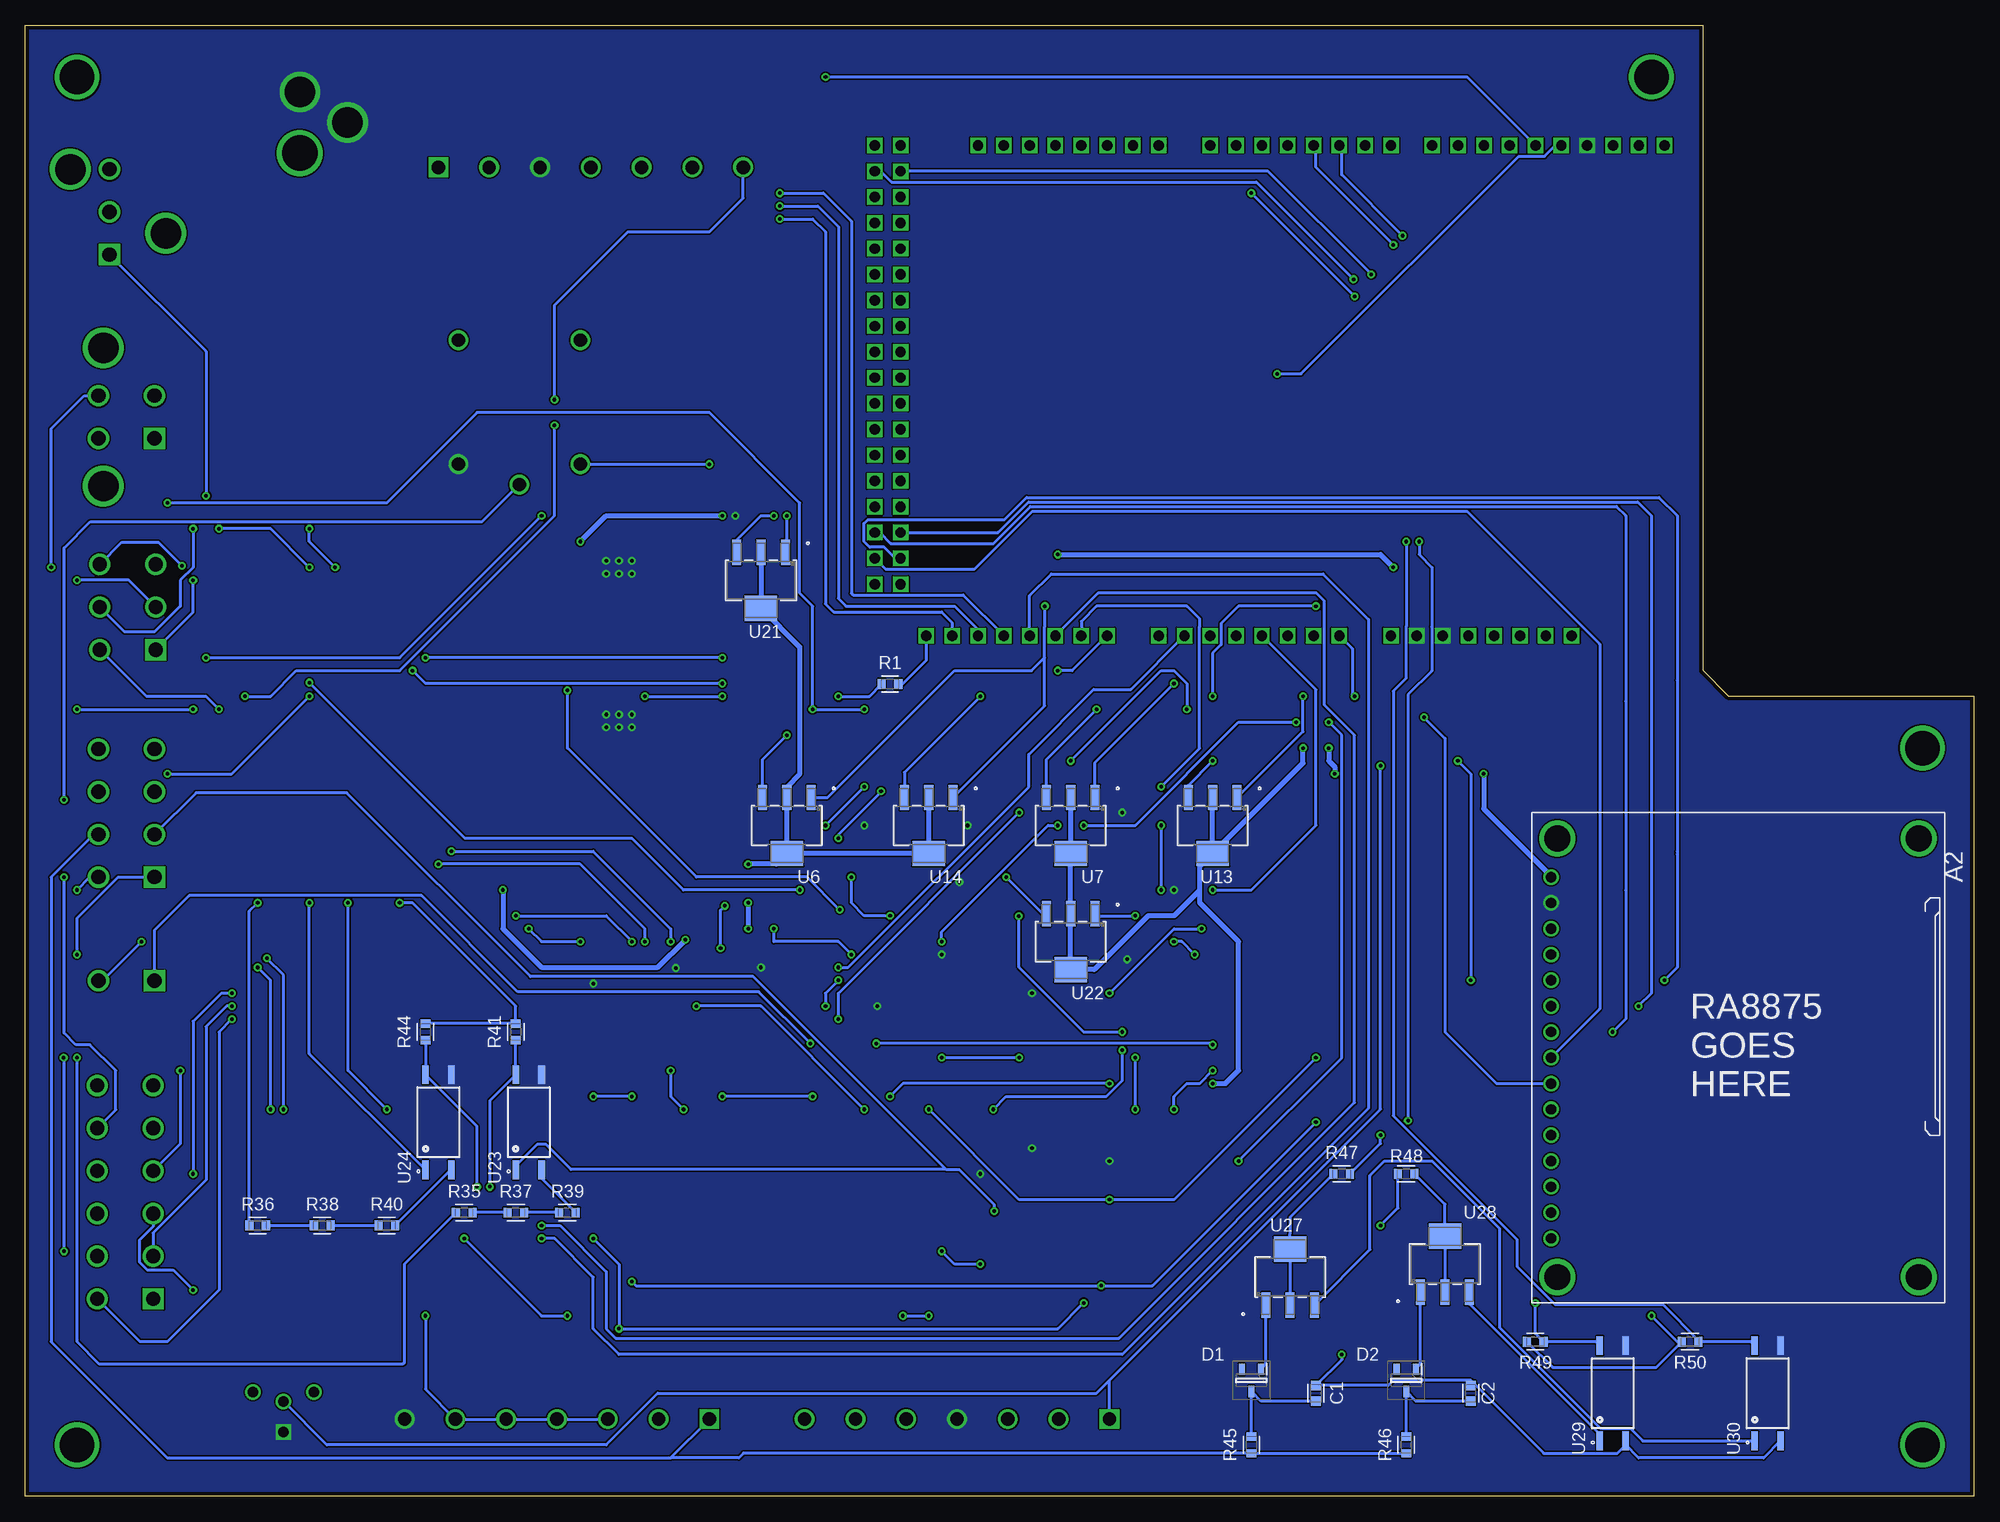
[diagram p6: board, bottom side, seen from below]

Size 191.77 x 144.78 mm. Coordinates in mm from the lower left corner, seen from the top.
Outline: 0,0 191.77,0 191.77,144.78 26.67,144.78 26.67,81.28 24.13,78.74 0,78.74 0,0
Copper layers (1*16): Top 0.035mm / dielectric 1.5mm / Bottom 0.035mm
Design rules "default *": minimum track width 6mil, minimum drill 0.35mm, track to track 6mil, track to pad 6mil, pad to pad 6mil, via to via 6mil, smd to smd 6mil, copper to edge 0.4mm, drill to drill 6mil, minimum pad ring 10mil, minimum via ring 8mil, stop-mask expansion 4mil, vias tented up to drill 0mil, thermal gap 10mil

### Footprints (pad centres in the part's own frame; a part is rotated, then mirrored left to right if it is on the bottom)
ARDUINO2560PINS = drill 1.016 square: !RESET! 5.08,0; +3V3 7.62,0; +5V 10.16,0; +5V-2 66.04,48.26; +5V-3 68.58,48.26; AREF -4.064,48.26; D0 35.56,48.26; D1 33.02,48.26; D2 30.48,48.26; D3 27.94,48.26; D4 25.4,48.26; D5 22.86,48.26; D6 20.32,48.26; D7 17.78,48.26; D8 13.716,48.26; D9 11.176,48.26; D10 8.636,48.26; D11 6.096,48.26; D12 3.556,48.26; D13 1.016,48.26; D14 40.64,48.26; D15 43.18,48.26; D16 45.72,48.26; D17 48.26,48.26; D18 50.8,48.26; D19 53.34,48.26; D20 -6.604,48.26; D20-2 55.88,48.26; D21 -9.144,48.26; D21-2 58.42,48.26; D22 66.04,45.72; D23 68.58,45.72; D24 66.04,43.18; D25 68.58,43.18; D26 66.04,40.64; D27 68.58,40.64; D28 66.04,38.1; D29 68.58,38.1; D30 66.04,35.56; D31 68.58,35.56; D32 66.04,33.02; D33 68.58,33.02; D34 66.04,30.48; D35 68.58,30.48; D36 66.04,27.94; D37 68.58,27.94; D38 66.04,25.4; D39 68.58,25.4; D40 66.04,22.86; D41 68.58,22.86; D42 66.04,20.32; D43 68.58,20.32; D44 66.04,17.78; D45 68.58,17.78; D46 66.04,15.24; D47 68.58,15.24; D48 66.04,12.7; D49 68.58,12.7; D50 66.04,10.16; D51 68.58,10.16; D52 66.04,7.62; D53 68.58,7.62; D54 22.86,0; D55 25.4,0; D56 27.94,0; D57 30.48,0; D58 33.02,0; D59 35.56,0; D60 38.1,0; D61 40.64,0; D62 45.72,0; D63 48.26,0; D64 50.8,0; D65 53.34,0; D66 55.88,0; D67 58.42,0; D68 60.96,0; D69 63.5,0; GND 12.7,0; GND-2 15.24,0; GND-3 -1.524,48.26; GND-4 66.04,5.08; GND-5 68.58,5.08; IOREF 2.54,0; NC 0,0; VIN 17.78,0
RA88 = drill 1.016: 1 39.37,-0.635; 2 36.83,-0.635; 3 34.29,-0.635; 4 31.75,-0.635; 5 29.21,-0.635; 6 26.67,-0.635; 7 24.13,-0.635; 8 21.59,-0.635; 9 19.05,-0.635; 10 16.51,-0.635; 11 13.97,-0.635; 12 11.43,-0.635; 13 8.89,-0.635; 14 6.35,-0.635; 15 3.81,-0.635 | drill 2.54: P$1 0,0; P$2 43.18,0; P$3 43.18,35.56; P$4 0,35.56
CAPC1608X85 = smd 0.921 x 0.97: 1 -0.775,0; 2 0.775,0
SOT95P248X115-3N = smd 1.1 x 0.6: 1 -1.1,0.95; 2 -1.1,-0.95; 3 1.1,0
CON_39301039 = drill 1.4 pad 1.9 square: 1 0,0 | drill 1.4 pad 1.9: 2 -4.2,0; 3 -8.4,0 | drill 3 pad 3: M1 -8.4,3.85; M2 -2.1,-5.55
CON_39281083 = drill 1.4 pad 1.9 square: 1 0,0 | drill 1.4 pad 1.9: 2 4.2,0; 3 8.4,0; 4 12.6,0; 5 0,-5.5; 6 4.2,-5.5; 7 8.4,-5.5; 8 12.6,-5.5
CON_39281023 = drill 1.4 pad 1.9 square: 1 0,0 | drill 1.4 pad 1.9: 2 0,-5.5
CON_39281123 = drill 1.4 pad 1.9 square: 1 0,0 | drill 1.4 pad 1.9: 2 4.2,0; 3 8.4,0; 4 12.6,0; 5 16.8,0; 6 21,0; 7 0,-5.5; 8 4.2,-5.5; 9 8.4,-5.5; 10 12.6,-5.5; 11 16.8,-5.5; 12 21,-5.5
CON_39281063 = drill 1.4 pad 1.9 square: 1 0,0 | drill 1.4 pad 1.9: 2 4.2,0; 3 8.4,0; 4 0,-5.5; 5 4.2,-5.5; 6 8.4,-5.5
CON_39299046 = drill 1.4 pad 1.9 square: 1 0,0 | drill 1.4 pad 1.9: 2 -4.2,0; 3 0,5.5; 4 -4.2,5.5 | drill 3 pad 3: M1 4.7,5.04; M2 -8.9,5.04
CUI_PJ-202AH = drill 3.5: P$1 -6.5,0 | drill 3: P$2 -0.5,0; P$3 -3.5,4.7
CUI_TB001-500-07BE = drill 1.3 square: 1 0,0 | drill 1.3: 2 5,0; 3 10,0; 4 15,0; 5 20,0; 6 25,0; 7 30,0
CON_430450212_MOL = drill 1.02 pad 1.52 square: 1 0,0 | drill 1.02 pad 1.52: 2 0,3 | drill 1.02 pad 1.02: M1 3,3.94; M2 -3,3.94
J107F1CS203VDC.80 = drill 1.3: C -2,-6; L1 0,0; L2 0,-12; NC 12.2,0; NO 12.2,-12
RESC1608X60 = smd 0.799 x 0.974: 1 -0.815,0; 2 0.815,0
LM1086CT-3.3/NOPB = smd 4 x 1.05: GND 0,2.54; IN 0,-2.54; OUT 0,0 | smd 6.9 x 10.5: OUT2 10.65,0
SOIC254P1020X230-4N = smd 1.84 x 0.64: 1 -4.685,1.27; 2 -4.685,-1.27; 3 4.685,-1.27; 4 4.685,1.27
SOT-223_ONS = smd 0.889 x 2.489: 1 -2.4,-2.756; 2 0,-2.756; 3 2.4,-2.756 | smd 3.2 x 2.489: 4 0,2.756
SOP254P962X315-4N = smd 1.9 x 0.75: 1 -4.3,1.27; 2 -4.3,-1.27; 3 4.3,-1.27; 4 4.3,1.27

### Placement (x,y rotation side)
A1  39.6,84.71 0 top
A2  41,64.77 270 bottom
C1  64.77,10.16 90 bottom
C2  49.53,10.16 90 bottom
D1  71.12,11.43 270 bottom
D2  55.88,11.43 270 bottom
J1  183.5,122.23 270 top
J2  179.07,60.96 90 top
J3  179.07,50.76 90 top
J4  179.2,19.45 90 top
J5  178.95,83.34 90 top
J6  179.07,104.14 270 top
J7  164.76,138.72 90 top
J8  151.13,130.81 180 top
J9  85.09,7.62 0 top
J10  124.46,7.62 0 top
J11  166.37,6.35 0 top
K1  137.16,101.6 90 top
R1  106.69,79.96 0 bottom
R2  117.98,89.79 0 top
R3  82.54,21 180 top
R4  91.49,54.61 0 top
R5  85.04,38.13 180 top
R6  76.27,38.14 180 top
R7  97.91,54.63 180 top
R8  72.98,38.09 0 top
R9  126.28,34.93 90 top
R10  88.9,20.92 0 top
R11  86.31,54.63 180 top
R12  113.03,68.58 90 top
R13  85.09,68.58 90 top
R14  123.75,55.84 0 top
R15  89.33,38.06 0 top
R16  93.98,38.07 0 top
R17  106.13,25.39 90 top
R18  72.42,55.88 270 top
R19  116.19,25.4 90 top
R20  133.22,25.53 90 top
R21  106.24,30.6 90 top
R22  72.44,49.56 270 top
R23  116.24,30.51 90 top
R24  133.33,30.45 90 top
R25  106.22,35.55 90 top
R26  72.44,43.13 270 top
R27  116.24,35.64 90 top
R28  133.33,35.61 90 top
R29  71.12,68.58 90 top
R30  99.06,68.58 90 top
R31  98.98,38.06 0 top
R32  115.56,55.87 180 top
R33  110.48,55.84 180 top
R34  134.62,55.86 180 top
R35  148.59,27.94 0 bottom
R36  168.91,26.67 0 bottom
R37  143.51,27.94 0 bottom
R38  162.56,26.67 0 bottom
R39  138.43,27.94 0 bottom
R40  156.21,26.67 0 bottom
R41  143.51,45.72 90 bottom
R42  97.79,62.23 180 top
R43  118.11,93.98 0 top
R44  152.4,45.72 90 bottom
R45  71.12,5.08 90 bottom
R46  55.88,5.08 90 bottom
R47  62.23,31.75 0 bottom
R48  55.88,31.75 180 bottom
R49  43.18,15.24 180 bottom
R50  27.94,15.24 180 bottom
U1  133.35,71.12 0 top
U2  133.35,86.36 0 top
U3  80.94,30.04 90 top
U4  97.54,46.55 90 top
U5  80.04,46.55 90 top
U6  116.84,66.04 180 bottom
U7  88.9,66.04 180 bottom
U8  116.84,73.66 0 top
U9  88.9,73.66 0 top
U10  124.63,46.55 90 top
U11  89.32,30.04 90 top
U12  88.79,46.55 90 top
U13  74.93,66.04 180 bottom
U14  102.87,66.04 180 bottom
U15  97.7,30.04 90 top
U16  106.76,46.55 90 top
U17  115.79,46.55 90 top
U18  132.44,46.55 90 top
U19  74.93,73.66 0 top
U20  102.87,73.66 0 top
U21  119.38,90.17 180 bottom
U22  88.9,54.61 180 bottom
U23  142.24,36.83 90 bottom
U24  151.13,36.83 90 bottom
U25  119.38,106.68 90 top
U26  88.9,63.5 0 top
U27  67.31,21.59 0 bottom
U28  52.07,22.86 0 bottom
U29  35.56,10.16 90 bottom
U30  20.32,10.16 90 bottom

### Tracks (layer width: path | path; a pad name or v marks a point on that pad's centre or on a via)
!CS!
  Top 0.3: R2.1 110.72,89.79 A1.D53
  Bottom 0.3: A1.D53 107.12,91.27 98.39,91.27 92.68,96.97 49.91,96.97 36.83,83.89 36.83,47.99 A2.8
+3V3  (via drill 0.35)
  Top 0.5: v137.16,93.98 144,87.14 U2.OUT2 151.62,93.98 189.23,93.98 190.5,92.71 190.5,13.97 179.79,3.26 94.45,3.26 J9.2 | R2.2 118.8,92.13 v123.19,96.52 123.19,105.9 U25.4
  Bottom 0.5: v137.16,93.98 134.62,96.52 v123.19,96.52
  pour Top (no thermals): 139.85,80.16 148.44,80.16 148.44,92.56 139.85,92.56
  pour Top (no thermals): 131.47,85.88 140.06,85.88 140.06,86.72 131.47,86.72
+5V  (via drill 0.35)
  Top 0.3: v154.94,58.42 151.13,58.42 143.75,65.8 | v31.75,17.78 29.21,20.32 29.21,54.61 35.56,60.96 A2.15
  Top 0.5: R14.2 133.78,55.84 R34.2 | R16.2 93.91,37.18 90.94,37.18 90.15,37.97 R15.2 89.18,39.03 76.35,39.03 R6.2 | R16.2 95.68,38.95 98.91,38.95 R31.2 99.8,21.95 114.13,7.62 J9.7 112.55,5.08 97.63,5.08 J9.3 | R14.2 123.68,54.95 120.65,54.95 | 120.65,54.95 115.68,54.95 R32.2 114.75,55.96 113.98,56.73 110.47,56.73 109.67,55.93 R33.2 109.24,56.28 96.72,56.28 96.42,55.98 | 133.9,71.12 U1.OUT U1.OUT2 | 143.75,65.8 144,66.06 U1.OUT2 | R6.2 73.84,38.14 R8.2 | 96.42,55.98 94.8,54.36 R16.2 | R7.2 96.42,55.31 96.42,55.98 | R6.2 75.46,40.11 v74.93,40.64 | v120.65,62.23 v120.65,58.42 | v120.65,55.88 120.65,54.95 | v66.04,73.66 v63.5,73.66 | v62.91,71.12 v48.26,71.12 | U1.OUT2 145.27,69.85 145.27,60.18 v144.78,59.69 | R14.2 125.62,54.79 v126.82,54.79
  Bottom 0.3: v154.94,58.42 153.67,58.42 143.51,48.26 R41.2 R44.2 | R49.2 41.45,12.7 31.29,12.7 R50.2 29.21,15.24 v31.75,17.78
  Bottom 0.5: v74.93,40.64 73.66,40.64 72.39,41.91 72.39,54.61 76.2,58.42 76.2,59.69 | 76.2,59.69 76.2,62.01 U13.4 | U13.4 U13.2 | U14.2 U14.4 U6.4 | U6.4 U6.2 116.84,69.85 115.57,71.12 115.57,83.6 U21.4 U21.2 | U6.4 117.89,62.23 v120.65,62.23 | v120.65,58.42 v120.65,55.88 | U13.4 66.04,72.17 v66.04,73.66 | v63.5,73.66 63.5,72.39 62.91,71.8 v62.91,71.12 | U7.2 U7.4 U22.2 U22.4 86.58,51.85 81.28,57.15 78.74,57.15 76.2,59.69 | v144.78,59.69 144.78,55.88 140.97,52.07 129.54,52.07 v126.82,54.79 | v48.26,71.12 48.26,67.67 41.64,61.05 A2.15
  pour Top (no thermals): 139.85,64.92 148.44,64.92 148.44,77.32 139.85,77.32
  pour Top (no thermals): 131.47,70.64 139.8,70.64 139.8,71.48 131.47,71.48
+9V  (via drill 0.35)
  Top 0.5: A1.VIN 57.15,84.94 v57.15,91.44 | v90.17,92.71 98.47,92.71 107.36,83.82 U2.IN
  Bottom 0.5: v57.15,91.44 58.42,92.71 v90.17,92.71
  pour Top (no thermals): 143.66,120.8 147.17,120.8 147.17,131.93 143.66,131.93
  pour Top: 125.88,120.8 144.63,120.8 144.63,124.31 125.88,124.31
  pour Top: 125.88,91.59 129.39,91.59 129.39,121.77 125.88,121.77
  pour Top (no thermals): 125.88,67.46 135.74,67.46 135.74,69.7 125.88,69.7
  pour Top (no thermals): 125.88,82.7 135.74,82.7 135.74,84.94 125.88,84.94
  pour Top: 125.81,67.39 129.46,67.39 129.46,92.63 125.81,92.63
+9V_PRE
  pour Top (no thermals): 162.52,131.94 162.45,131.87 162.36,131.83 150.11,131.83 150.11,129.79 167.39,129.79 167.39,134.37 162.56,134.37 162.56,132.03
ALARM_SIGNAL  (via drill 0.35)
  Top 0.3: U5.4 78.74,51.27 v78.74,54.61 | v74.93,59.69 74.93,59.38 76.71,57.61 v76.71,53.34 77.02,53.03 77.02,45.27 72.17,40.42 R8.1
  Bottom 0.3: v78.74,54.61 77.98,54.61 v76.71,53.34 | v74.93,59.69 71.12,59.69 64.77,66.04 64.77,79.4 A1.D57
BL_PWR_NEUTRAL_SIGNAL  (via drill 0.35)
  Top 0.3: v146.05,30.48 142.24,26.67 v140.97,26.67
  Bottom 0.3: R41.1 U23.4 146.05,38.97 v146.05,30.48 | v140.97,26.67 139.17,26.67 134.62,22.12 134.62,16.51 133.69,15.58 84.16,15.58 60.96,38.77 60.96,74.93 63.94,77.91 63.94,88.14 64.7,88.9 86.21,88.9 A1.D64
BL_PWR_SIGNAL  (via drill 0.35)
  Top 0.3: U15.4 96.43,36.32 R31.1 96.56,38.06 v96.52,38.1 | v83.82,43.91 83.82,44.45 80.69,47.58 80.69,59.41 80.69,64.09 78.74,66.04 78.74,71.12 72.62,77.24 A1.D58
  Bottom 0.3: v96.52,38.1 95.25,39.37 85.4,39.37 83.82,40.95 v83.82,43.91
BLOW_CONTROL_POWER_SIGNAL  (via drill 0.35)
  Top 0.3: U3.4 77.09,37.3 R6.1 78.7,38.14 v78.74,38.1 | v80.01,59.69 80.01,57.15 77.47,54.61 77.47,44.45 v74.93,41.91 | v80.01,66.04 v80.01,69.85
  Bottom 0.3: v78.74,38.1 78.74,39.37 77.47,40.64 76.2,40.64 v74.93,41.91 | v80.01,66.04 v80.01,59.69 | v80.01,69.85 76.23,73.63 76.23,85.6 76.2,85.62 76.2,86.36 77.47,87.63 86.36,87.63 87.86,86.13 A1.D63
BLOW_P1  (via drill 0.35)
  Top 0.3: v186.69,43.18 v186.69,53.34
  Bottom 0.3: R35.1 154.49,22.86 154.49,13.15 154.61,13.03 184.48,13.03 186.69,15.24 v186.69,43.18 | v186.69,53.34 186.69,56.93 182.66,60.96 J2.1
BLOW_P2  (via drill 0.35)
  Top 0.3: U15.1 v96.43,28.08
  Bottom 0.3: v96.43,28.08 96.43,28.73 99.89,32.19 101.16,32.19 | U23.1 143.51,32.54 141.41,34.64 140.52,34.64 138.08,32.19 101.16,32.19 | 101.16,32.19 120.14,51.17 142.06,51.17 160.15,69.26 174.97,69.26 J2.2
BLOW_P3  (via drill 0.35)
  Top 0.3: R17.1 107.84,22.86 163.09,22.86 167.64,27.41 v167.64,38.1 | v168.91,52.07 170.18,53.34 180.34,53.34 181.61,54.61 181.61,59.69 181.61,67.31 179.56,69.36 J2.3
  Bottom 0.3: v167.64,38.1 167.64,50.8 v168.91,52.07
BLOW_P4  (via drill 0.35)
  Top 0.3: U3.1 83.52,29.21 v85.09,29.21 | v132.08,54.61 132.08,53.81 126.53,48.26 v125.73,48.26 | v143.51,57.15 175.26,57.15 176.53,58.42 176.53,72.39 177.7,73.56 J2.4 | v102.87,38.1 v109.22,38.1 | v64.77,43.18 58.42,36.83 v58.42,35.56 v58.42,26.67
  Bottom 0.3: v102.87,38.1 93.98,29.21 v85.09,29.21 78.74,29.21 v64.77,43.18 | v143.51,57.15 134.62,57.15 v132.08,54.61 | v109.22,38.1 119.38,48.26 v125.73,48.26 | v58.42,26.67 56.69,28.39 R48.2 | R47.2 58.42,34.75 v58.42,35.56
BLOW_P5  (via drill 0.35)
  Top 0.3: R3.1 85.9,21 v85.9,20.74 | v188,43.18 187.96,43.22 187.96,58.42 v186.69,59.69 | v132.08,21.14 143.69,21.14 152.34,12.5 185.22,12.5 187.96,15.24 v187.96,24.13 | v64.77,36.83 64.77,16.51 v62.23,13.97
  Bottom 0.3: v132.08,21.14 131.68,20.74 v85.9,20.74 80.86,20.74 v64.77,36.83 | v186.69,59.69 185.42,60.96 J2.5 | v187.96,24.13 187.96,43.14 v188,43.18 | C2.2 49.53,11.43 | 49.53,11.43 57.15,11.43 57.64,10.93 C1.2 62.23,13.47 v62.23,13.97 | U30.2 20.71,3.81 33.02,3.81 34.29,5.08 U29.2 34.29,5.08 35.11,4.25 42.35,4.25 49.53,11.43
BLOW_P6  (via drill 0.35)
  Top 0.3: v111.76,78.74 v123.19,78.74 | v130.81,78.74 138.06,78.74 138.15,78.65 138.71,78.65 138.8,78.74 v163.83,78.74 | v177.8,71.12 179.22,71.12 184.57,65.77 J2.6
  Bottom 0.3: v130.81,78.74 v123.19,78.74 | v111.76,78.74 108.72,78.74 R1.1 | v177.8,71.12 171.45,71.12 v163.83,78.74 | J2.6 185.03,65.16 189.23,60.96 189.23,15.24 177.8,3.81 128.27,3.81 | 128.27,3.81 J10.1 | R46.1 R45.1 121.1,4.27 121.56,3.81 128.27,3.81
BLOW_P7  (via drill 0.35)
  Top 0.3: 171.45,78.74 175.8,78.74 184.57,69.97 J2.7 | 171.45,78.74 160.02,67.31 v160.02,58.42 | v156.21,38.1 156.21,33.02 v148.59,25.4 | v138.43,17.78 132.08,17.78 129.46,15.16 J10.2 | 171.45,78.74 v170.18,78.74 | v139.7,105.41 v139.7,107.95
  Bottom 0.3: v160.02,58.42 160.02,41.91 v156.21,38.1 | v148.59,25.4 140.97,17.78 v138.43,17.78 | v170.18,78.74 167.64,78.74 165.1,81.28 154.94,81.28 139.7,96.52 v139.7,105.41 | v139.7,107.95 139.7,117.24 132.48,124.46 124.46,124.46 121.13,127.79 J8.7
BSKT_120_GND_SIGNAL  (via drill 0.35)
  Top 0.3: v147.32,30.48 147.32,28.68 144.04,25.4 v140.97,25.4
  Bottom 0.3: R44.1 U24.4 147.32,36.44 v147.32,30.48 | v140.97,25.4 139.7,25.4 135.89,21.59 135.89,16.51 133.35,13.97 83.82,13.97 59.58,38.2 59.58,86.32 64.07,90.81 90.8,90.81 92.94,88.67 A1.D65
BSKT_CTRL  (via drill 0.35)
  Top 0.3: v91.44,87.63 v68.58,110.49
  Bottom 0.3: v91.44,87.63 91.44,85.62 91.47,85.6 91.47,82.55 | U14.1 91.47,77.8 91.47,82.55 | A1.D13 41.21,132.97 42.27,131.91 44.81,131.91 66.23,110.49 v68.58,110.49 | U6.1 112.81,68.8 100.33,81.28 92.74,81.28 91.47,82.55
BSKT_P1  (via drill 0.35)
  Top 0.3: v175.26,90.17 165.19,80.1 v163.83,80.1 | v115.57,59.69 111.76,59.69 v110.49,60.96 | R11.1 90.66,54.63 R4.1 91.95,55.88 95.25,55.88 96.52,57.15 v106.68,57.15
  Bottom 0.3: v110.49,60.96 110.49,58.42 109.22,57.15 v106.68,57.15 | v163.83,80.1 148.5,64.77 132.08,64.77 127,59.69 v115.57,59.69 | v175.26,90.17 175.26,87.03 J5.1
BSKT_P2  (via drill 0.35)
  Top 0.3: v168.91,58.42 175.26,64.77 v175.26,77.47 | v186.69,90.17 v186.69,77.47
  Bottom 0.3: v168.91,58.42 169.72,57.61 R36.1 | v186.69,77.47 v175.26,77.47 | v186.69,90.17 181.58,90.17 J5.2
BSKT_P3  (via drill 0.35)
  Top 0.3: U4.1 100.61,46.2 107.2,46.2 111.76,50.76 v111.76,50.8 | v113.03,48.26 114.3,49.53 127.01,49.53 130.81,53.33 v130.81,54.61 | v151.13,62.23 178.95,90.05 J5.3
  Bottom 0.3: v111.76,50.8 113.03,49.53 v113.03,48.26 | v130.81,54.61 130.81,55.88 137.16,62.23 v151.13,62.23
BSKT_P4  (via drill 0.35)
  Top 0.3: v172.72,77.47 172.72,64.77 166.37,58.42 v163.83,58.42
  Bottom 0.3: U24.1 163.83,43.58 v163.83,58.42 | v172.72,77.47 173.99,78.74 179.85,78.74 J5.4
BSKT_P5  (via drill 0.35)
  Top 0.3: U8.4 121.14,76.98 120.65,77.47 v114.3,77.47 | v109.22,77.47 107.17,75.42 U20.4 | v177.8,97.79 v175.26,95.25
  Bottom 0.3: v109.22,77.47 v114.3,77.47 114.3,87.63 115.57,88.9 115.57,97.79 124.46,106.68 147.32,106.68 156.21,97.79 v177.8,97.79 | v175.26,95.25 175.26,91.44 176.53,90.17 176.53,87.63 179.07,85.09 182,85.09 J5.5
BSKT_P6  (via drill 0.35)
  Top 0.3: v176.37,91.6 176.37,90.32 165.47,79.42 138.52,79.42 v138.43,79.33 | U12.1 83.82,45.56 v83.82,45.72 | v111.63,57.74 111.54,57.83 94.71,57.83 v94,57.12
  Bottom 0.3: v176.37,91.6 178.68,93.91 182.28,93.91 J5.6 | v83.82,45.72 87.63,45.72 93.98,52.07 93.98,57.1 v94,57.12 | v111.63,57.74 114.85,60.96 125.73,60.96 138.43,73.66 v138.43,79.33
EX1  (via drill 0.35)
  Top 0.3: J8.6 126.13,128.67 125.73,128.27 v117.52,128.27
  Bottom 0.3: A1.D66 99.5,88.73 110.32,88.73 110.49,88.9 110.49,125.51 113.25,128.27 v117.52,128.27
EX2  (via drill 0.35)
  Top 0.3: J8.5 129.54,130.81 125.73,127 v117.52,127
  Bottom 0.3: A1.D67 98.02,85.32 100.33,87.63 111.02,87.63 111.76,88.37 111.76,124.99 113.77,127 v117.52,127
EX3  (via drill 0.35)
  Top 0.3: J8.4 132.94,130.81 131.66,129.53 129.53,129.53 125.73,125.73 v117.52,125.73
  Bottom 0.3: A1.D68 100.56,86.01 101.6,87.04 112.23,87.04 113.03,87.85 113.03,124.46 114.3,125.73 v117.52,125.73
GAS_VALVE_SIGNAL  (via drill 0.35)
  Top 0.3: U18.4 135.43,55.5 R34.1 136.68,54.61 v137.16,54.61 | v90.17,81.28 90.76,80.69 123.78,80.69 124.46,80.01 124.46,66.75 131.07,60.14 137.98,60.14 v142.24,55.88
  Bottom 0.3: A1.D62 88.75,81.28 v90.17,81.28 | v142.24,55.88 140.97,54.61 v137.16,54.61
GND  (via drill 0.35)
  Top 0.3: U3.3 83.38,34.72 v85.09,33.02 | U11.3 92.27,34.72 v92.71,34.29 | U4.3 100.91,53.34 v101.6,53.34 | U16.3 107.95,51.16 v107.95,48.26 | U17.3 118.54,51.23 v119.38,52.07 | U15.3 98.97,32.93 v97.79,31.75 | U18.3 135.14,51.23 v135.89,50.49 | U10.3 126.99,51.23 v127.76,52.01 | v83.34,52.86 81.71,51.23 U5.3 | U12.3 91.76,49.53 v92.71,49.53 | R42.1 99.85,60.99 v99.85,60.48 | R12.1 111.3,66.04 v109.22,66.04 | R30.1 v99.06,66.04 | R13.1 84.63,67.31 v83.82,67.31 | R29.1 78.74,60.14 v78.74,59.69 | R43.2 119.38,93.98 v121.92,96.52
  other vias: 134.62,90.81 133.35,90.81 132.08,90.81 134.62,92.08 133.35,92.08 132.08,76.96 133.35,76.96 134.62,76.96 134.62,75.69 133.35,75.69 132.08,75.69 132.08,92.08
  pour Bottom (no thermals): -1.6,-30.99 242.59,-30.99 242.59,165.6 207.64,200.55 -16.25,200.55 -16.25,-16.34
  pour Top (no thermals): 130.96,72.54 135.74,72.54 135.74,74.78 130.96,74.78
  pour Top: 130.96,72.54 135.74,72.54 135.74,77.83 130.96,77.83
  pour Top (no thermals): 130.96,87.78 135.74,87.78 135.74,92.94 130.96,92.94
INT  (via drill 0.35)
  Top 0.3: v50.8,72.39 60.01,81.61 60.01,118.74 v61.07,119.8 | v49.53,50.8 49.53,43.18 41.91,35.56 A2.5
  Bottom 0.3: v49.53,50.8 49.53,71.12 v50.8,72.39 | A1.D23 107.59,130.43 106.53,129.37 70.64,129.37 v61.07,119.8
JUMPER
  Top 0.3: J4.8 182.88,25.47 182.88,39.37 183.96,40.45 J4.12
L_BSKT_SIGNAL  (via drill 0.35)
  Top 0.3: v76.03,55.88 73.55,58.36 73.55,62.65 67.54,68.65 A1.D56 | R16.1 93.17,45.59 U12.4 86.79,51.23 v85.09,49.53
  Bottom 0.3: v85.09,49.53 78.74,55.88 v76.03,55.88
MISO  (via drill 0.35)
  Top 0.3: v33.02,48.26 A2.10
  Bottom 0.3: A1.D50 96.06,94.87 93.05,97.88 33.11,97.88 31.75,96.52 31.75,78.74 31.75,63.5 31.75,49.53 v33.02,48.26
MOSI  (via drill 0.35)
  Top 0.3: A2.9 v35.56,45.72
  Bottom 0.3: A1.D51 107.68,94.87 106.61,93.81 96.49,93.81 92.87,97.42 35.19,97.42 34.29,96.52 34.29,78.24 34.29,59.69 34.29,46.99 v35.56,45.72
MP_P1  (via drill 0.35)
  Top 0.3: U8.3 121.14,68.09 129.54,59.69 137.47,59.69 142.24,54.92 142.24,52.07 144.78,49.53 v171.45,49.53 | v175.26,31.75 175.26,23.39 J4.1
  Bottom 0.3: v171.45,49.53 172.5,49.53 175.26,46.77 v175.26,31.75 | v175.26,31.75
MP_P2  (via drill 0.35)
  Top 0.3: U20.3 109.22,70.34 v109.22,69.85 | v113.03,66.04 121.39,66.04 129.01,58.42 137.69,58.42 140.97,55.14 140.97,51.54 144.25,48.26 v171.45,48.26
  Bottom 0.3: v109.22,69.85 v113.03,66.04 | v171.45,48.26 171.98,48.26 173.99,46.25 173.99,31.15 179.2,25.94 J4.2
MP_P3  (via drill 0.35)
  Top 0.3: v175.26,20.32 172.72,17.78 v152.4,17.78
  Bottom 0.3: J4.3 179.2,26.58 180.55,25.22 180.55,23.09 179.76,22.3 177.24,22.3 v175.26,20.32 | v152.4,17.78 152.4,10.56 J10.6 J10.5 J10.4 J10.3
MP_P4  (via drill 0.35)
  Top 0.3: v111.76,46.99 118.23,46.99 U10.1 123.36,41.27 123.98,40.64 131.62,40.64 131.85,40.87 131.85,41.67 133.26,43.09 175.35,43.09 v176.53,41.91 | 91.44,69.85 91.44,73.17 U9.4 | v93.98,67.31 91.44,69.85 | 91.44,69.85 v88.9,72.39 | v77.47,77.47 77.47,76.69 U19.4
  Bottom 0.3: v111.76,46.99 111.76,49.53 v93.98,67.31 | v88.9,72.39 80.01,81.28 78.74,81.28 77.47,80.01 v77.47,77.47 | v176.53,41.91 176.53,34.72 J4.4
MP_P5
  Top 0.3: U18.1 131.17,42.47 132.57,43.87 176.53,43.87 176.66,43.87 179.65,43.87 181.61,41.91 181.61,36.83 181.03,36.25 J4.5
MP_P6  (via drill 0.35)
  Top 0.3: v106.68,39.37 v114.3,39.37 | v123.19,39.37 v132.08,39.37 | v135.89,39.37 178.12,39.37 J4.6 | U5.1 79.99,40.64 v85.09,40.64
  Bottom 0.3: v85.09,40.64 105.41,40.64 v106.68,39.37 | v114.3,39.37 v123.19,39.37 | v132.08,39.37 v135.89,39.37
MP_P7  (via drill 0.35)
  Top 0.3: U9.3 94.47,73.66 103.25,73.66 107.5,69.41 v107.57,69.41 | v111.76,64.77 120.87,64.77 128.49,57.15 137.16,57.15 139.7,54.61 139.7,50.8 143.51,46.99 v171.45,46.99
  Bottom 0.3: v111.76,64.77 111.76,65.15 107.57,69.34 v107.57,69.41 | v171.45,46.99 172.72,45.72 172.72,20.32 177.8,15.24 180.49,15.24 J4.7
MP_P9  (via drill 0.35)
  Top 0.3: U11.1 88.05,22.44 89.02,21.47 89.02,20.3 91.54,17.78 | v105.41,17.78 109.9,22.27 145.37,22.27 154.61,13.03 184.48,13.03 186.69,15.24 186.69,25.86 J4.9 | 91.54,17.78 v102.87,17.78 | 91.54,17.78 82.55,17.78 72.39,27.94 v72.39,33.02 | v63.5,76.2 63.94,76.64 63.94,85.6 64.12,85.77 64.18,85.77 64.77,86.36 v64.77,87.63 | v74.93,78.74 74.93,76.69 U19.3
  Bottom 0.3: v105.41,17.78 v102.87,17.78 | v72.39,33.02 62.23,43.18 62.23,74.93 v63.5,76.2 | v64.77,87.63 72.39,87.63 74.1,85.92 74.1,83.82 74.93,82.99 v74.93,78.74
MP_P10  (via drill 0.35)
  Top 0.3: R5.1 85.85,23.15 R10.1 87.63,20.46 v87.63,19.05 | R9.1 126.28,31.65 R20.1 133.9,25.4 v135.89,25.4 | 189.23,29.21 189.23,72.39 181.61,80.01 176.53,80.01 v173.99,82.55 | v140.97,96.52 140.97,109.99 144.78,113.8 K1.NO | 189.23,29.21 189.23,15.24 177.8,3.81 156.21,3.81 143.51,16.51 v133.35,16.51 | 189.23,29.21 186.39,32.05 J4.10
  Bottom 0.3: v135.89,25.4 133.35,22.86 v133.35,16.51 90.17,16.51 v87.63,19.05 | v173.99,82.55 154.94,82.55 v140.97,96.52
MP_P11  (via drill 0.35)
  Top 0.3: v187.96,60.96 v187.96,68.58
  Bottom 0.3: K1.C 146.83,95.93 185.38,95.93 187.96,93.35 v187.96,68.58 | J4.11 182.88,38.07 182.88,41.91 185.42,44.45 186.8,44.45 187.96,45.61 v187.96,60.96
N$1
  Top 0.3: R30.2 98.57,69.89 U20.2
N$2
  Top 0.3: R29.2 70.63,69.89 U19.2
N$3
  Top 0.3: R13.2 84.6,69.89 U9.2
N$4  (via drill 0.35)
  Top 0.3: U8.1 v116.84,74.93
  Bottom 0.3: U6.3 119.24,72.53 v116.84,74.93
N$5
  Top 0.3: R42.2 95.93,61.19 95.93,60.68 95.53,60.28 86.55,60.28 U26.2
N$6
  Top 0.3: R43.1 120.65,97.34 U25.2
N$8  (via drill 0.35)
  Top 0.3: v97.79,78.74 97.79,75.71 U20.1
  Bottom 0.3: U14.3 105.27,71.26 v97.79,78.74
N$9
  Bottom 0.3: U23.2 140.97,31.29 R39.2
N$10
  Bottom 0.3: R39.1 R37.2
N$11
  Bottom 0.3: R37.1 R35.2
N$12
  Bottom 0.3: R40.2 149.92,32.14 U24.2
N$13
  Bottom 0.3: R38.2 R40.1
N$14
  Bottom 0.3: R36.2 R38.1
N$15  (via drill 0.35)
  Top 0.3: U26.1 88.41,60.96 v95.25,60.96
  Bottom 0.3: v95.25,60.96 91.66,57.37 U22.3
N$16  (via drill 0.35)
  Top 0.3: v86.36,77.47 85.87,77.47 84.6,76.2 U9.1
  Bottom 0.3: U7.3 91.3,72.53 v86.36,77.47
N$17  (via drill 0.35)
  Top 0.3: U10.2 125.94,41.91 v128.27,41.91 | v127,38.1 126.28,37.38 R9.2
  Bottom 0.3: v128.27,41.91 128.27,39.37 v127,38.1
N$18  (via drill 0.35)
  Top 0.3: v74.93,72.39 72.39,74.93 U19.1
  Bottom 0.3: U13.3 77.33,69.99 v74.93,72.39
N$19  (via drill 0.35)
  Top 0.3: v118.11,96.52 U25.1
  Bottom 0.3: U21.3 121.78,94.12 119.38,96.52 v118.11,96.52
N$20
  Top 0.3: U12.2 84.22,47.7 84.22,53.36 R11.2
N$21
  Bottom 0.3: R46.2 D2.3 54.93,9.38 C2.1
N$22
  Top 0.3: R3.2 81.73,21.08 82.21,21.56 U3.2
N$23  (via drill 0.35)
  Top 0.3: R4.2 93.98,52.93 v93.98,43.18 | v101.6,43.18 100.28,41.86 U4.2
  Bottom 0.3: v93.98,43.18 v101.6,43.18
N$24
  Bottom 0.3: D2.1 54.47,12.99 U28.1
N$25
  Top 0.3: R10.2 89.72,24.48 U11.2
N$26  (via drill 0.35)
  Top 0.3: R5.2 84.19,38.1 v82.55,38.1 | U5.2 81.31,41.94 v82.55,43.18
  Bottom 0.3: v82.55,38.1 v82.55,43.18
N$27
  Bottom 0.3: A1.D69 103.1,82.32 105.46,79.96 R1.2
N$28  (via drill 0.35)
  Top 0.3: R25.2 101.6,31.74 v101.6,24.13 | v97.79,22.86 97.79,24.18 U15.2
  Bottom 0.3: v101.6,24.13 100.33,22.86 v97.79,22.86
N$29
  Top 0.3: R21.2 106.24,34.72 R25.1
N$30
  Top 0.3: R17.2 106.13,29.67 R21.1
N$31  (via drill 0.35)
  Top 0.3: U16.2 v108.03,44.59 | R26.2 72.79,42.31 v74.93,44.45
  Bottom 0.3: v74.93,44.45 75.07,44.59 v108.03,44.59
N$32
  Top 0.3: R22.2 R26.1
N$33
  Top 0.3: R18.2 72.42,50.39 R22.1
N$34
  Top 0.3: R27.2 116.96,36.45 117.06,36.55 U17.2
N$35
  Top 0.3: R23.2 R27.1
N$36
  Top 0.3: R19.2 116.19,29.64 R23.1
N$37
  Top 0.3: R28.2 133.33,40.88 133.71,41.27 U18.2
N$38
  Top 0.3: R28.1 R24.2
N$39
  Top 0.3: R20.2 133.22,29.53 R24.1
N$40
  Top 0.3: R12.2 112.54,69.89 U8.2
N$41
  Bottom 0.3: D1.1 69.71,12.99 U27.1
N$42
  Bottom 0.3: C1.1 70.17,9.38 71.03,10.25 | 71.03,10.25 D1.3 | R45.2 71.12,10.16 71.03,10.25
N$44
  Bottom 0.3: U28.3 49.67,18.96 36.83,6.12 U29.1
N$45
  Bottom 0.3: U30.1 32.62,5.47 33.84,6.7 36.77,6.7 46.7,16.64 46.7,26.38 53.34,33.02 58.01,33.02 59.44,31.59 59.44,24.3 U27.3
N$48
  Bottom 0.3: U27.2 U27.4 67.31,25.4 67.31,25.86 67.31,27.48 R47.1
N$49
  Bottom 0.3: R48.1 52.07,28.75 U28.4 U28.2
PM_P1  (via drill 0.35)
  Top 0.3: v114.52,44.59 U17.1
  Bottom 0.3: v114.52,44.59 119.6,49.67 143.31,49.67 152.78,59.14 175.64,59.14 179.07,55.71 J3.1
PM_P2  (via drill 0.35)
  Top 0.3: R19.1 116.76,24.01 162.44,24.01 166.37,27.94 v166.37,38.1 | v168.01,52.97 169.65,54.61 v180.34,54.61
  Bottom 0.3: v166.37,38.1 166.37,51.33 v168.01,52.97 | J3.2 184.19,50.76 v180.34,54.61
PM_PWR_SIGNAL  (via drill 0.35)
  Top 0.3: R33.1 111.3,54.45 U17.4 113.68,52.07 v111.76,52.07
  Bottom 0.3: A1.D60 82.99,79.42 86.64,79.42 93.02,73.04 93.02,69.84 110.8,52.07 v111.76,52.07
PON_SIGNAL  (via drill 0.35)
  Top 0.3: v123.36,53.96 U10.4 | v122.94,58.13 R14.1 121.66,55.84 119.76,57.74 115.29,57.74 113.79,59.24 84.27,59.24 83.02,60.49 83.02,75.43 80.24,78.21 A1.D61
  Bottom 0.3: v123.36,53.96 123.36,57.7 v122.94,58.13
POWER_CTRL  (via drill 0.35)
  Top 0.3: v116.84,96.52 116.84,137.16 114.3,139.7 v113.03,139.7
  Bottom 0.3: A1.D12 49.89,139.7 v113.03,139.7 | U21.1 116.84,93.07 v116.84,96.52
PUMP_CTRL  (via drill 0.35)
  Top 0.3: v78.74,80.01 76.23,82.52 76.23,85.6 76.2,85.62 76.2,89.54 67.79,97.95 67.79,120.61 52.51,135.89 48.62,135.89 A1.D11
  Bottom 0.3: U7.1 86.5,72.25 v78.74,80.01
PWM_HIGH_SIGNAL  (via drill 0.35)
  Top 0.3: v55.88,93.98 55.88,121.92 v57.15,123.19
  Bottom 0.3: v55.88,93.98 55.88,85.62 55.91,85.6 55.91,80.51 57.15,79.27 57.15,37.47 44.98,25.3 44.98,22.63 41.25,18.9 30.63,18.9 27.12,15.39 R50.1 21.98,15.24 U30.4 | v57.15,123.19 64.77,130.81 64.77,132.74 A1.D4
PWM_LOW_SIGNAL  (via drill 0.35)
  Top 0.3: v54.61,93.98 54.61,122.45 v56.25,124.09 | v43.18,19.05 43.18,24.13 55.71,36.66 v55.71,37
  Bottom 0.3: v54.61,93.98 54.61,92.71 53.34,91.44 53.34,85.62 53.37,85.6 53.37,81.25 55.71,78.91 v55.71,37 | v56.25,124.09 62.23,130.07 62.23,132.74 A1.D5 | U29.4 37.22,15.24 R49.1 43.18,16.05 v43.18,19.05
R_BSKT_SIGNAL  (via drill 0.35)
  Top 0.3: U4.4 98.73,53.69 R7.1 98.74,54.61 v101.6,54.61 | v87.63,66.04 v90.17,66.04 | v66.72,76.2 65,77.92 A1.D55
  Bottom 0.3: v87.63,66.04 82.55,66.04 72.39,76.2 v66.72,76.2 | v101.6,54.61 101.6,55.57 91.13,66.04 v90.17,66.04
RELAY_POW  (via drill 0.35)
  Top 0.3: v124.46,101.6 124.46,107.17 U25.3
  Bottom 0.3: K1.L1 v124.46,101.6
RST  (via drill 0.35)
  Top 0.3: v59.32,120.28 59.18,120.14 59.18,81.73 v54.13,76.68
  Bottom 0.3: A1.D22 69.47,130.43 v59.32,120.28 | A2.7 46.99,40.64 52.07,45.72 52.07,74.62 v54.13,76.68
S_VALVE_CTRL  (via drill 0.35)
  Top 0.3: v82.55,57.15 81.28,58.42 81.28,74.93 74.11,82.1 74.11,83.81 74.1,83.82 74.1,91 67.31,97.79 67.31,117.03 51.37,132.97 A1.D9
  Bottom 0.3: U22.1 86.28,57.15 v82.55,57.15
S_VALVE_SIGNAL  (via drill 0.35)
  Top 0.3: U16.4 107.59,53.34 v110.49,53.34 | v118.11,55.88 R32.1 113.83,58.42 83.82,58.42 81.96,60.28 81.96,75.52 75.16,82.32 A1.D59
  Bottom 0.3: v110.49,53.34 111.76,54.61 118.11,54.61 v118.11,55.88
SCK  (via drill 0.35)
  Top 0.3: A2.11 v30.48,50.8
  Bottom 0.3: A1.D52 106.15,92.33 107.25,93.43 108.69,93.43 109.25,93.98 109.25,95.76 108.86,96.14 95.43,96.14 93.24,98.33 31.02,98.33 29.21,96.52 29.21,80.32 29.21,63.5 29.21,63.23 29.21,52.07 v30.48,50.8
SP_A1  (via drill 0.35)
  Top 0.3: v60.96,78.74 60.96,74.93 58.42,72.39 v58.42,71.9
  Bottom 0.3: A1.D54 61.19,83.44 61.19,78.97 v60.96,78.74 | J9.1 85.09,11.43 | 85.09,11.43 58.42,38.1 v58.42,71.9 | J11.2 162.1,5.08 134.62,5.08 129.54,10.16 86.36,10.16 85.09,11.43
SP_D1
  Top 0.3: A1.D7 57.38,135.66 55.88,137.16 43.18,137.16 41.91,135.89 41.91,86.43 40.79,85.31 40.79,76.05 50.8,66.04 61.27,66.04 67.31,60 67.31,27.94 82.55,12.7 105.41,12.7 110.09,8.02 J9.6
SP_D2
  Top 0.3: A1.D6 59.92,136.93 58.42,138.43 40.64,138.43 39.37,137.16 39.37,86.43 37.99,85.05 37.99,77.05 50.27,64.77 60.74,64.77 66.04,59.47 66.04,28.57 83.18,11.43 101.28,11.43 J9.5
SV_P1  (via drill 0.35)
  Top 0.3: J6.1 181.61,106.68 181.61,113.99 184.85,117.24 184.85,133.06 175.67,142.24 86.36,142.24 76.23,132.11 76.23,132.08 72.41,128.27 v71.12,128.27 | v60.96,118.11 60.62,117.77 60.62,82.06 61.64,81.04 61.64,73.35 72.42,62.57 R18.1
  Bottom 0.3: v60.96,118.11 v71.12,128.27
SV_P4  (via drill 0.35)
  Top 0.3: U16.1 105.49,43.26 112.21,49.98 123.77,49.98 124.01,50.22 124.01,51.01 127.61,54.61 v128.27,54.61 | v149.86,63.5 150.5,63.5 177.6,90.6 177.6,92.3 178.39,93.09 186.31,93.09 187.96,91.44 v189.23,91.44
  Bottom 0.3: v128.27,54.61 128.27,55.88 135.89,63.5 v149.86,63.5 | v189.23,91.44 189.23,105.08 185.97,108.34 J6.4
SVR_P1  (via drill 0.35)
  Top 0.3: U26.3 91.44,63.99 91.44,68.58 87.63,72.39 87.63,80.01 90.17,82.55 v123.19,82.55 | v152.4,82.55 v161.29,91.44 | v163.83,95.25 165.1,96.52 172.04,96.52 v173.99,98.47
  Bottom 0.3: v123.19,82.55 v152.4,82.55 | v161.29,91.44 163.83,93.98 v163.83,95.25 | v173.99,98.47 173.99,112.71 J1.1
SVR_P3  (via drill 0.35)
  Top 0.3: v123.19,80.01 111.76,80.01 110.49,78.74 110.49,70.16 109.03,68.69 97.12,68.69 U26.4 | v153.67,81.28 v163.83,91.44 | v172.72,95.25 176.53,99.06 176.53,116.84 180.34,120.65 180.34,127.46 J1.3
  Bottom 0.3: v123.19,80.01 152.4,80.01 v153.67,81.28 | v163.83,91.44 167.64,95.25 v172.72,95.25
TH_CALL_CTRL  (via drill 0.35)
  Top 0.3: v66.04,78.74 66.04,83.8 66.07,83.82 66.07,117.04 52.3,130.81 49.53,130.81 48.24,132.1 A1.D10
  Bottom 0.3: U13.1 66.04,75.29 v66.04,78.74
TH_CALL_SIGNAL
  Top 0.3: U11.4 88.05,37.59 R15.1
VIA1  (via drill 3.4)
  other vias: 186.69,5.08
VIA2  (via drill 3.4)
  other vias: 5.08,5.08
VIA3  (via drill 3.4)
  other vias: 31.75,139.7
VIA4  (via drill 3.4)
  other vias: 186.69,139.7
VIA5  (via drill 3.4)
  other vias: 5.08,73.66

### Text on the board
tPlace: BL. / P7 | EX1 | EX2 | EX3 | GND | +9V / POST | +9V / PRE | SOL. V. SW. | SOL. V. | BASKET | BLOWER | PM | RA8875 / GOES / ON / BOTTOM | MAIN POWER HARNESS | SP. / A1 | +3V3 | +5V | GND | SP. / D2 | SP. / D1 | +5V | BL. / P6 | BL. / P7 | AC / GND | AC / GND | AC / GND | AC / GND | GND | Auto Power Box Tester / version 1.1 / July 2022
bPlace: RA8875 / GOES / HERE